# EAGLE schematic icyradio (EAGLE 9.5.1), part 1 of 2
CNAME: None; CREVISION: 1; DESIGNER: Joao Silva

## Sheet 1 of 10: SMC MCU
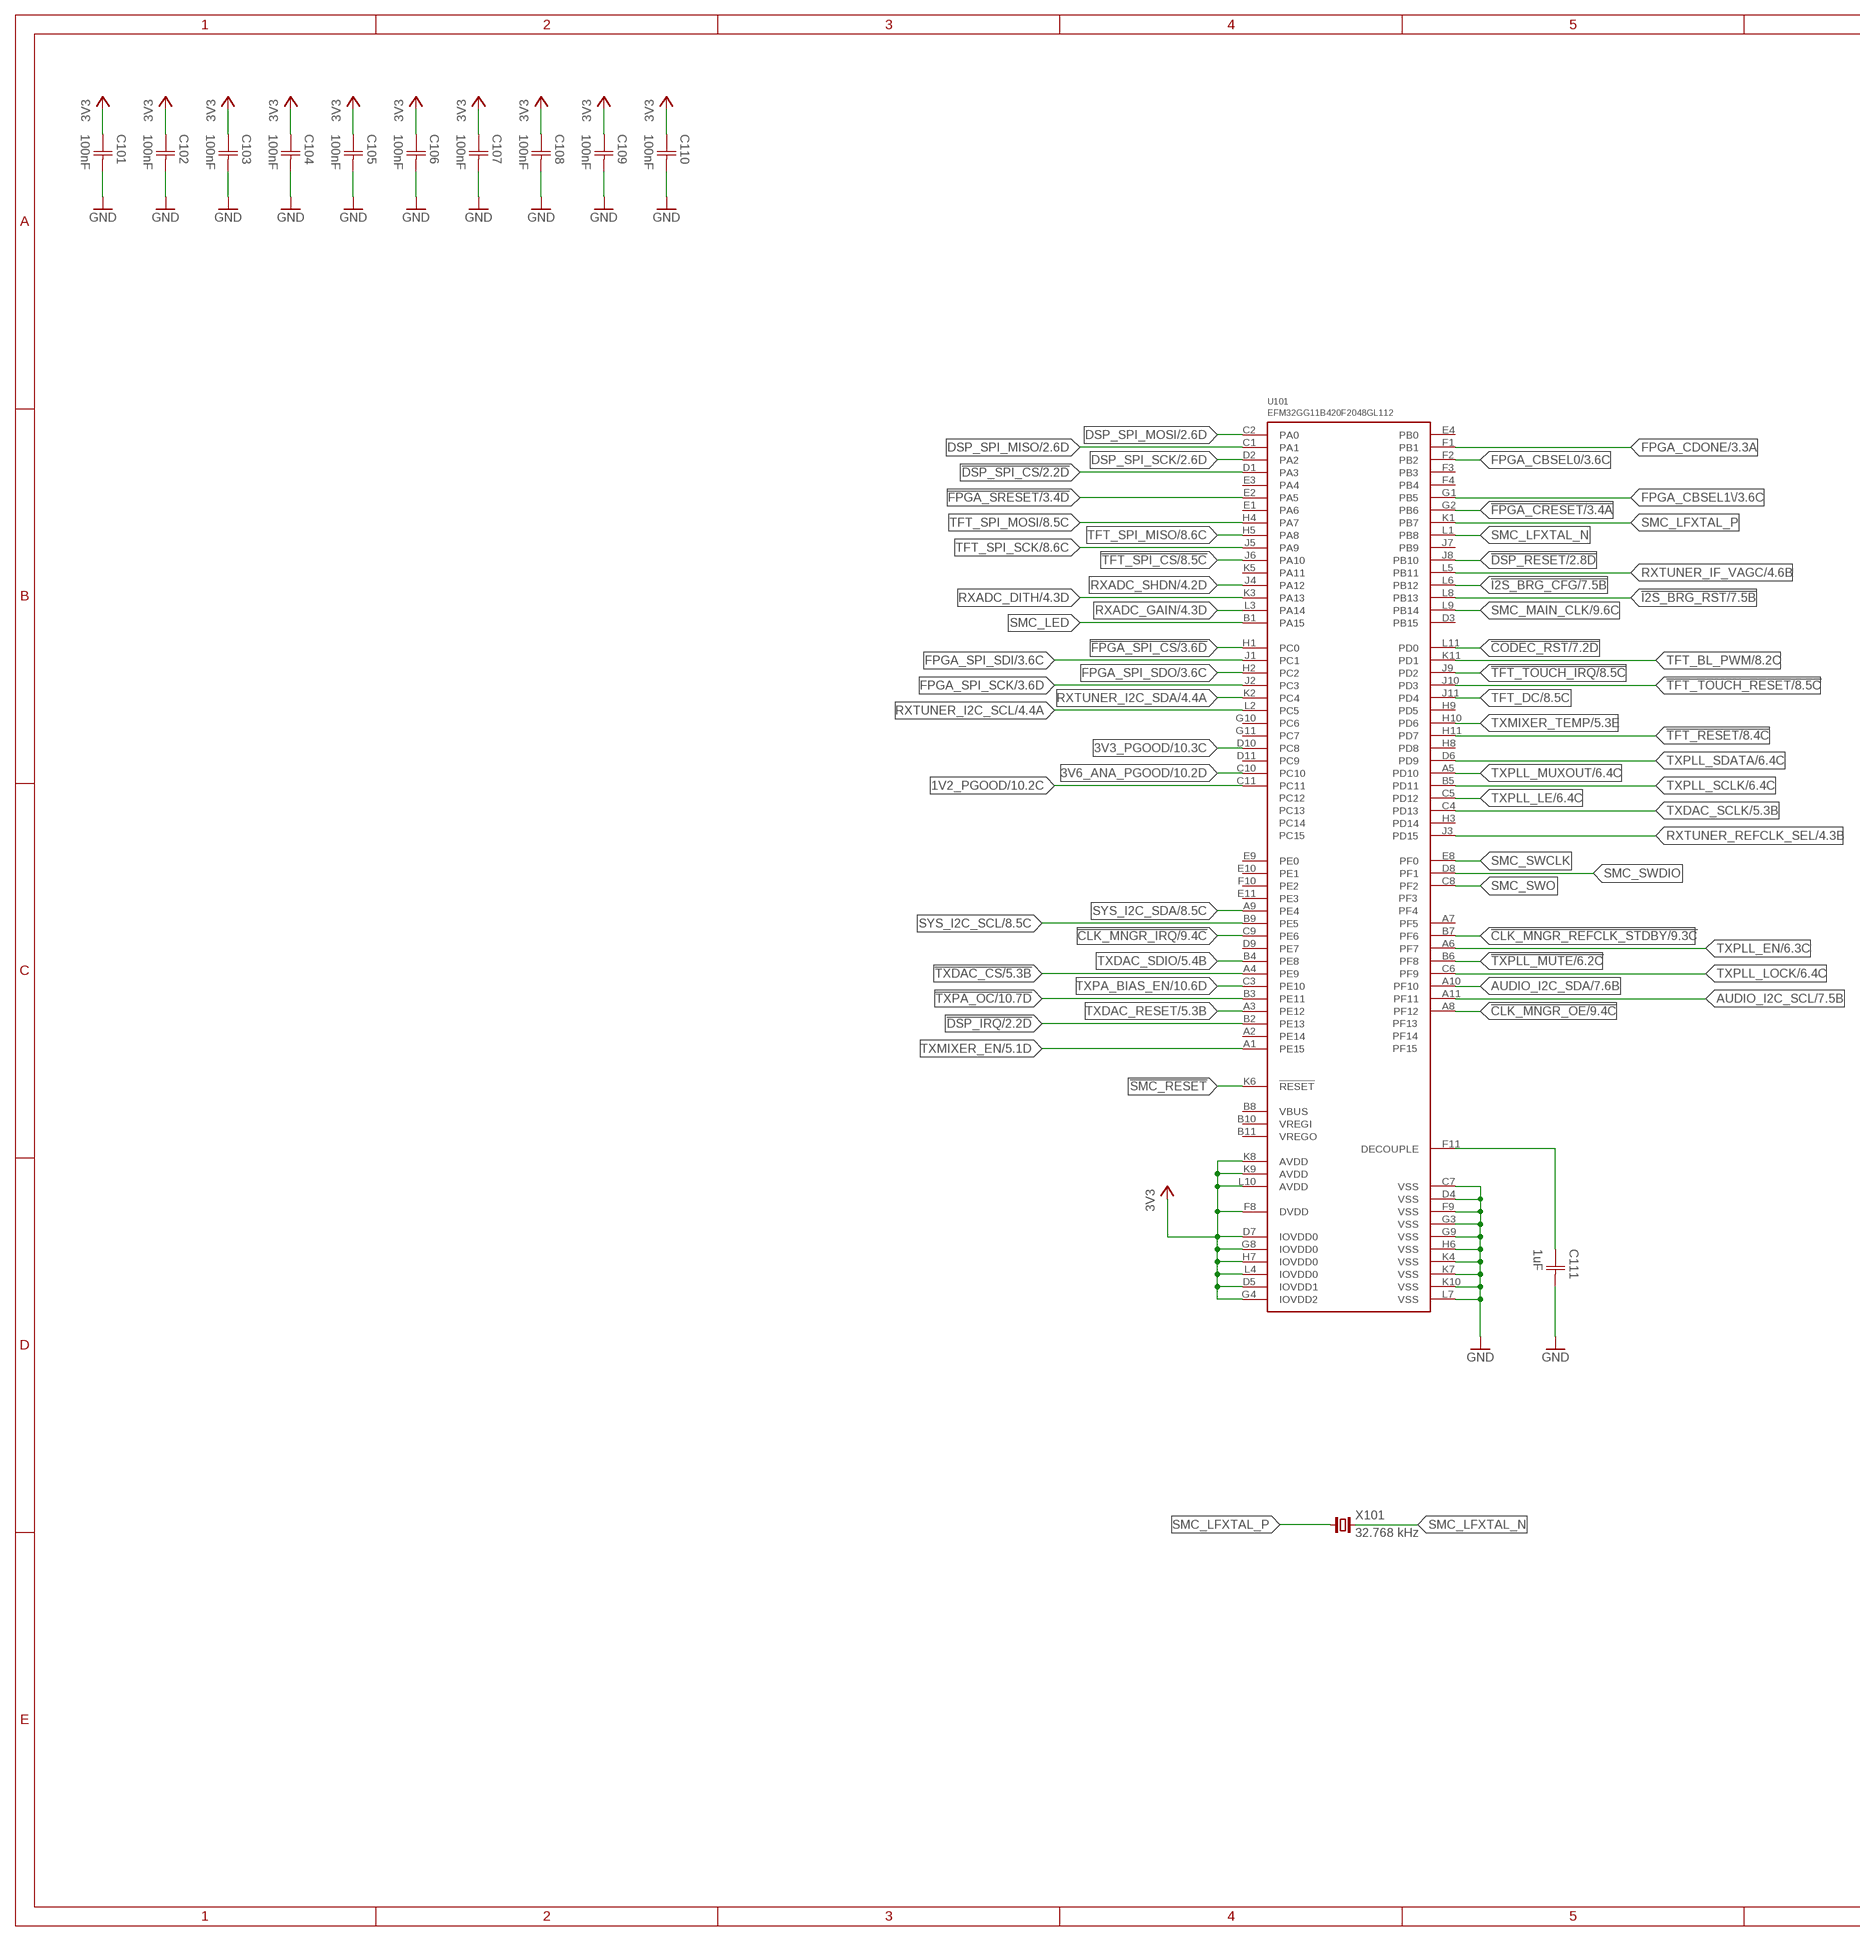
[diagram p0: schematic, sheet 1, part 1 of 2]
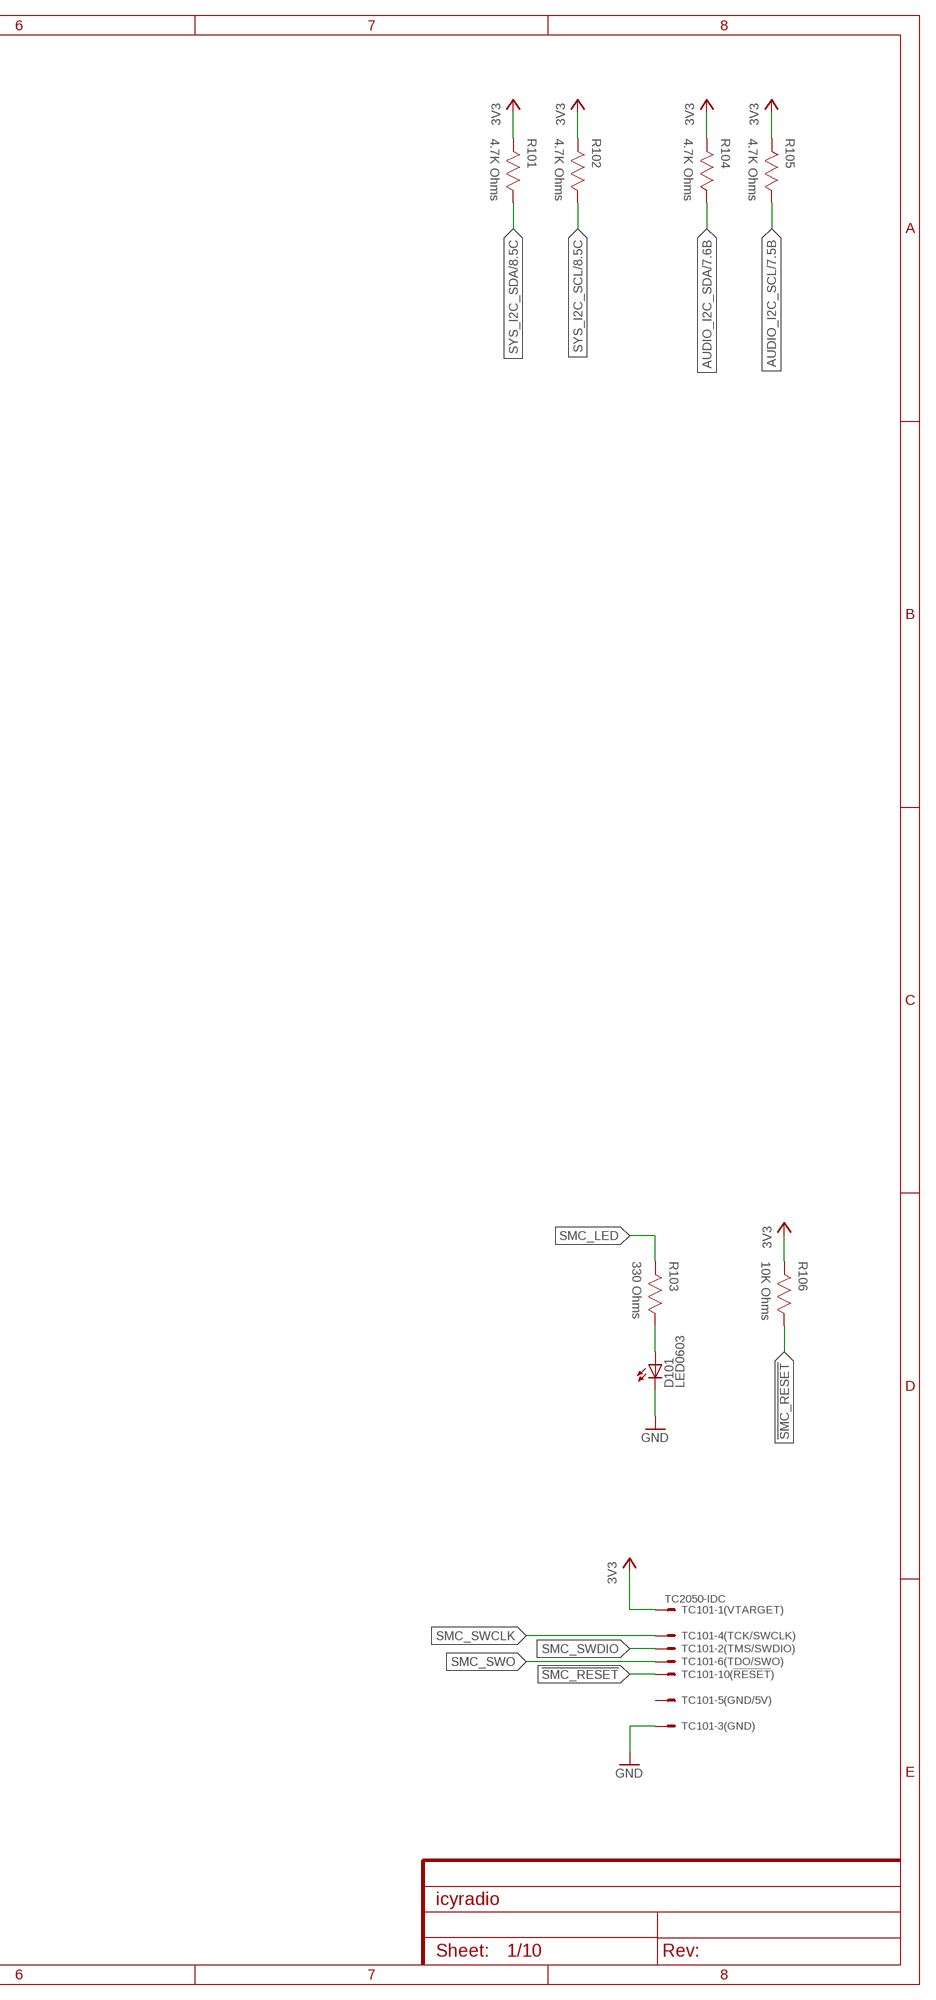
[diagram p1: schematic, sheet 1, part 2 of 2]

### Parts
C101  100nF  CAPACITOR-0603  [CAP0603]
C102  100nF  CAPACITOR-0603  [CAP0603]
C103  100nF  CAPACITOR-0603  [CAP0603]
C104  100nF  CAPACITOR-0603  [CAP0603]
C105  100nF  CAPACITOR-0603  [CAP0603]
C106  100nF  CAPACITOR-0603  [CAP0603]
C107  100nF  CAPACITOR-0603  [CAP0603]
C108  100nF  CAPACITOR-0603  [CAP0603]
C109  100nF  CAPACITOR-0603  [CAP0603]
C110  100nF  CAPACITOR-0603  [CAP0603]
C111  1uF  CAPACITOR-0603  [CAP0603]
D101  LED0603  [0603]
R101  4.7K Ohms  RESISTOR-0603  [RES0603]
R102  4.7K Ohms  RESISTOR-0603  [RES0603]
R103  330 Ohms  RESISTOR-0603  [RES0603]
R104  4.7K Ohms  RESISTOR-0603  [RES0603]
R105  4.7K Ohms  RESISTOR-0603  [RES0603]
R106  10K Ohms  RESISTOR-0603  [RES0603]
TC101  TC2050-IDC  [TC2050-IDC]
U101  EFM32GG11B420F2048GL112  [BGA112]
X101  32.768 kHz  CRYSTAL2-SMD-3215  [2-SMD-3215]

### Nets
1V2_PGOOD: U101.C11 ; also sheet 10
3V3: C101.1(C1) C102.1(C1) C103.1(C1) C104.1(C1) C105.1(C1) C106.1(C1) C107.1(C1) C108.1(C1) C109.1(C1) C110.1(C1) R101.2 R102.2 R104.2 R105.2 R106.2 TC101.1 U101.D5(IOVDD1) U101.D7(IOVDD0) U101.F8(DVDD) U101.G4(IOVDD2) U101.G8(IOVDD0) U101.H7(IOVDD0) U101.K8(AVDD) U101.K9(AVDD) U101.L4(IOVDD0) U101.L10(AVDD) ; also sheet 2,3,4,5,6,7,8,9,10
3V3_PGOOD: U101.D10(PC8) ; also sheet 10
3V6_ANA_PGOOD: U101.C10 ; also sheet 10
!CLK_MNGR_IRQ: U101.C9(PE6) ; also sheet 9
!CLK_MNGR_OE: U101.A8(PF12) ; also sheet 9
!CLK_MNGR_REFCLK_STDBY: U101.B7(PF6) ; also sheet 9
!CODEC_RST: U101.L11(PD0) ; also sheet 7
!DSP_IRQ: U101.B2(PE13) ; also sheet 2
!DSP_RESET: U101.J8(PB10) ; also sheet 2
!DSP_SPI_CS: U101.D1(PA3) ; also sheet 2
!FPGA_CRESET: U101.G2(PB6) ; also sheet 3
!FPGA_SPI_CS: U101.H1(PC0) ; also sheet 3
!FPGA_SRESET: U101.E2(PA5) ; also sheet 3
!I2S_BRG_CFG: U101.L6(PB12) ; also sheet 7
!I2S_BRG_RST: U101.L8(PB13) ; also sheet 7
!SMC_RESET: R106.1 TC101.10 U101.K6(!RESET)
!TFT_RESET: U101.H11(PD7) ; also sheet 8
!TFT_SPI_CS: U101.J6(PA10) ; also sheet 8
!TFT_TOUCH_IRQ: U101.J9(PD2) ; also sheet 8
!TFT_TOUCH_RESET: U101.J10(PD3) ; also sheet 8
!TXDAC_CS: U101.A4(PE9) ; also sheet 5
!TXPA_OC: U101.B3(PE11) ; also sheet 10
!TXPLL_MUTE: U101.B6(PF8) ; also sheet 6
AUDIO_I2C_SCL: R105.1 U101.A11(PF11) ; also sheet 7
AUDIO_I2C_SDA: R104.1 U101.A10(PF10) ; also sheet 7
DSP_SPI_MISO: U101.C1(PA1) ; also sheet 2
DSP_SPI_MOSI: U101.C2(PA0) ; also sheet 2
DSP_SPI_SCK: U101.D2(PA2) ; also sheet 2
FPGA_CBSEL0: U101.F2(PB2) ; also sheet 3
FPGA_CBSEL1\: U101.G1(PB5) ; also sheet 3
FPGA_CDONE: U101.F1(PB1) ; also sheet 3
FPGA_SPI_SCK: U101.J2(PC3) ; also sheet 3
FPGA_SPI_SDI: U101.J1(PC1) ; also sheet 3
FPGA_SPI_SDO: U101.H2(PC2) ; also sheet 3
GND: C101.2(C2) C102.2(C2) C103.2(C2) C104.2(C2) C105.2(C2) C106.2(C2) C107.2(C2) C108.2(C2) C109.2(C2) C110.2(C2) C111.2(C2) D101.1(C) TC101.3 U101.C7(VSS) U101.D4(VSS) U101.F9(VSS) U101.G3(VSS) U101.G9(VSS) U101.H6(VSS) U101.K4(VSS) U101.K7(VSS) U101.K10(VSS) U101.L7(VSS) ; also sheet 2,3,4,5,6,7,8,9,10
N$144: D101.2(A) R103.1
RXADC_DITH: U101.K3(PA13) ; also sheet 4
RXADC_GAIN: U101.L3(PA14) ; also sheet 4
RXADC_SHDN: U101.J4(PA12) ; also sheet 4
RXTUNER_I2C_SCL: U101.L2(PC5) ; also sheet 4
RXTUNER_I2C_SDA: U101.K2(PC4) ; also sheet 4
RXTUNER_IF_VAGC: U101.L5(PB11) ; also sheet 4
RXTUNER_REFCLK_SEL: U101.J3(PD15) ; also sheet 4
SMC_LED: R103.2 U101.B1(PA15)
SMC_LFXTAL_N: U101.L1(PB8) X101.2
SMC_LFXTAL_P: U101.K1(PB7) X101.1
SMC_MAIN_CLK: U101.L9(PB14) ; also sheet 9
SMC_SWCLK: TC101.4 U101.E8(PF0)
SMC_SWDIO: TC101.2 U101.D8(PF1)
SMC_SWO: TC101.6 U101.C8(PF2)
SMC_VCORE: C111.1(C1) U101.F11(DECOUPLE)
SYS_I2C_SCL: R102.1 U101.B9(PE5) ; also sheet 8,9
SYS_I2C_SDA: R101.1 U101.A9(PE4) ; also sheet 8,9
TFT_BL_PWM: U101.K11(PD1) ; also sheet 8
TFT_DC: U101.J11(PD4) ; also sheet 8
TFT_SPI_MISO: U101.H5(PA8) ; also sheet 8
TFT_SPI_MOSI: U101.H4(PA7) ; also sheet 8
TFT_SPI_SCK: U101.J5(PA9) ; also sheet 8
TXDAC_RESET: U101.A3(PE12) ; also sheet 5
TXDAC_SCLK: U101.C4(PD13) ; also sheet 5
TXDAC_SDIO: U101.B4(PE8) ; also sheet 5
TXMIXER_EN: U101.A1(PE15) ; also sheet 5
TXMIXER_TEMP: U101.H10(PD6) ; also sheet 5
TXPA_BIAS_EN: U101.C3(PE10) ; also sheet 10
TXPLL_EN: U101.A6(PF7) ; also sheet 6
TXPLL_LE: U101.C5(PD12) ; also sheet 6
TXPLL_LOCK: U101.C6(PF9) ; also sheet 6
TXPLL_MUXOUT: U101.A5(PD10) ; also sheet 6
TXPLL_SCLK: U101.B5(PD11) ; also sheet 6
TXPLL_SDATA: U101.D6(PD9) ; also sheet 6
Unconnected: TC101.5 TC101.7 TC101.8 TC101.9 U101.A2(PE14) U101.A7(PF5) U101.B8(VBUS) U101.B10(VREGI) U101.B11(VREGO) U101.D3(PB15) U101.D9(PE7) U101.D11(PC9) U101.E1(PA6) U101.E3(PA4) U101.E4(PB0) U101.E9(PE0) U101.E10(PE1) U101.E11(PE3) U101.F3(PB3) U101.F4(PB4) U101.F10(PE2) U101.G10(PC6) U101.G11(PC7) U101.H3(PD14) U101.H8(PD8) U101.H9(PD5) U101.J7(PB9) U101.K5(PA11)

## Sheet 2 of 10: DSP MCU
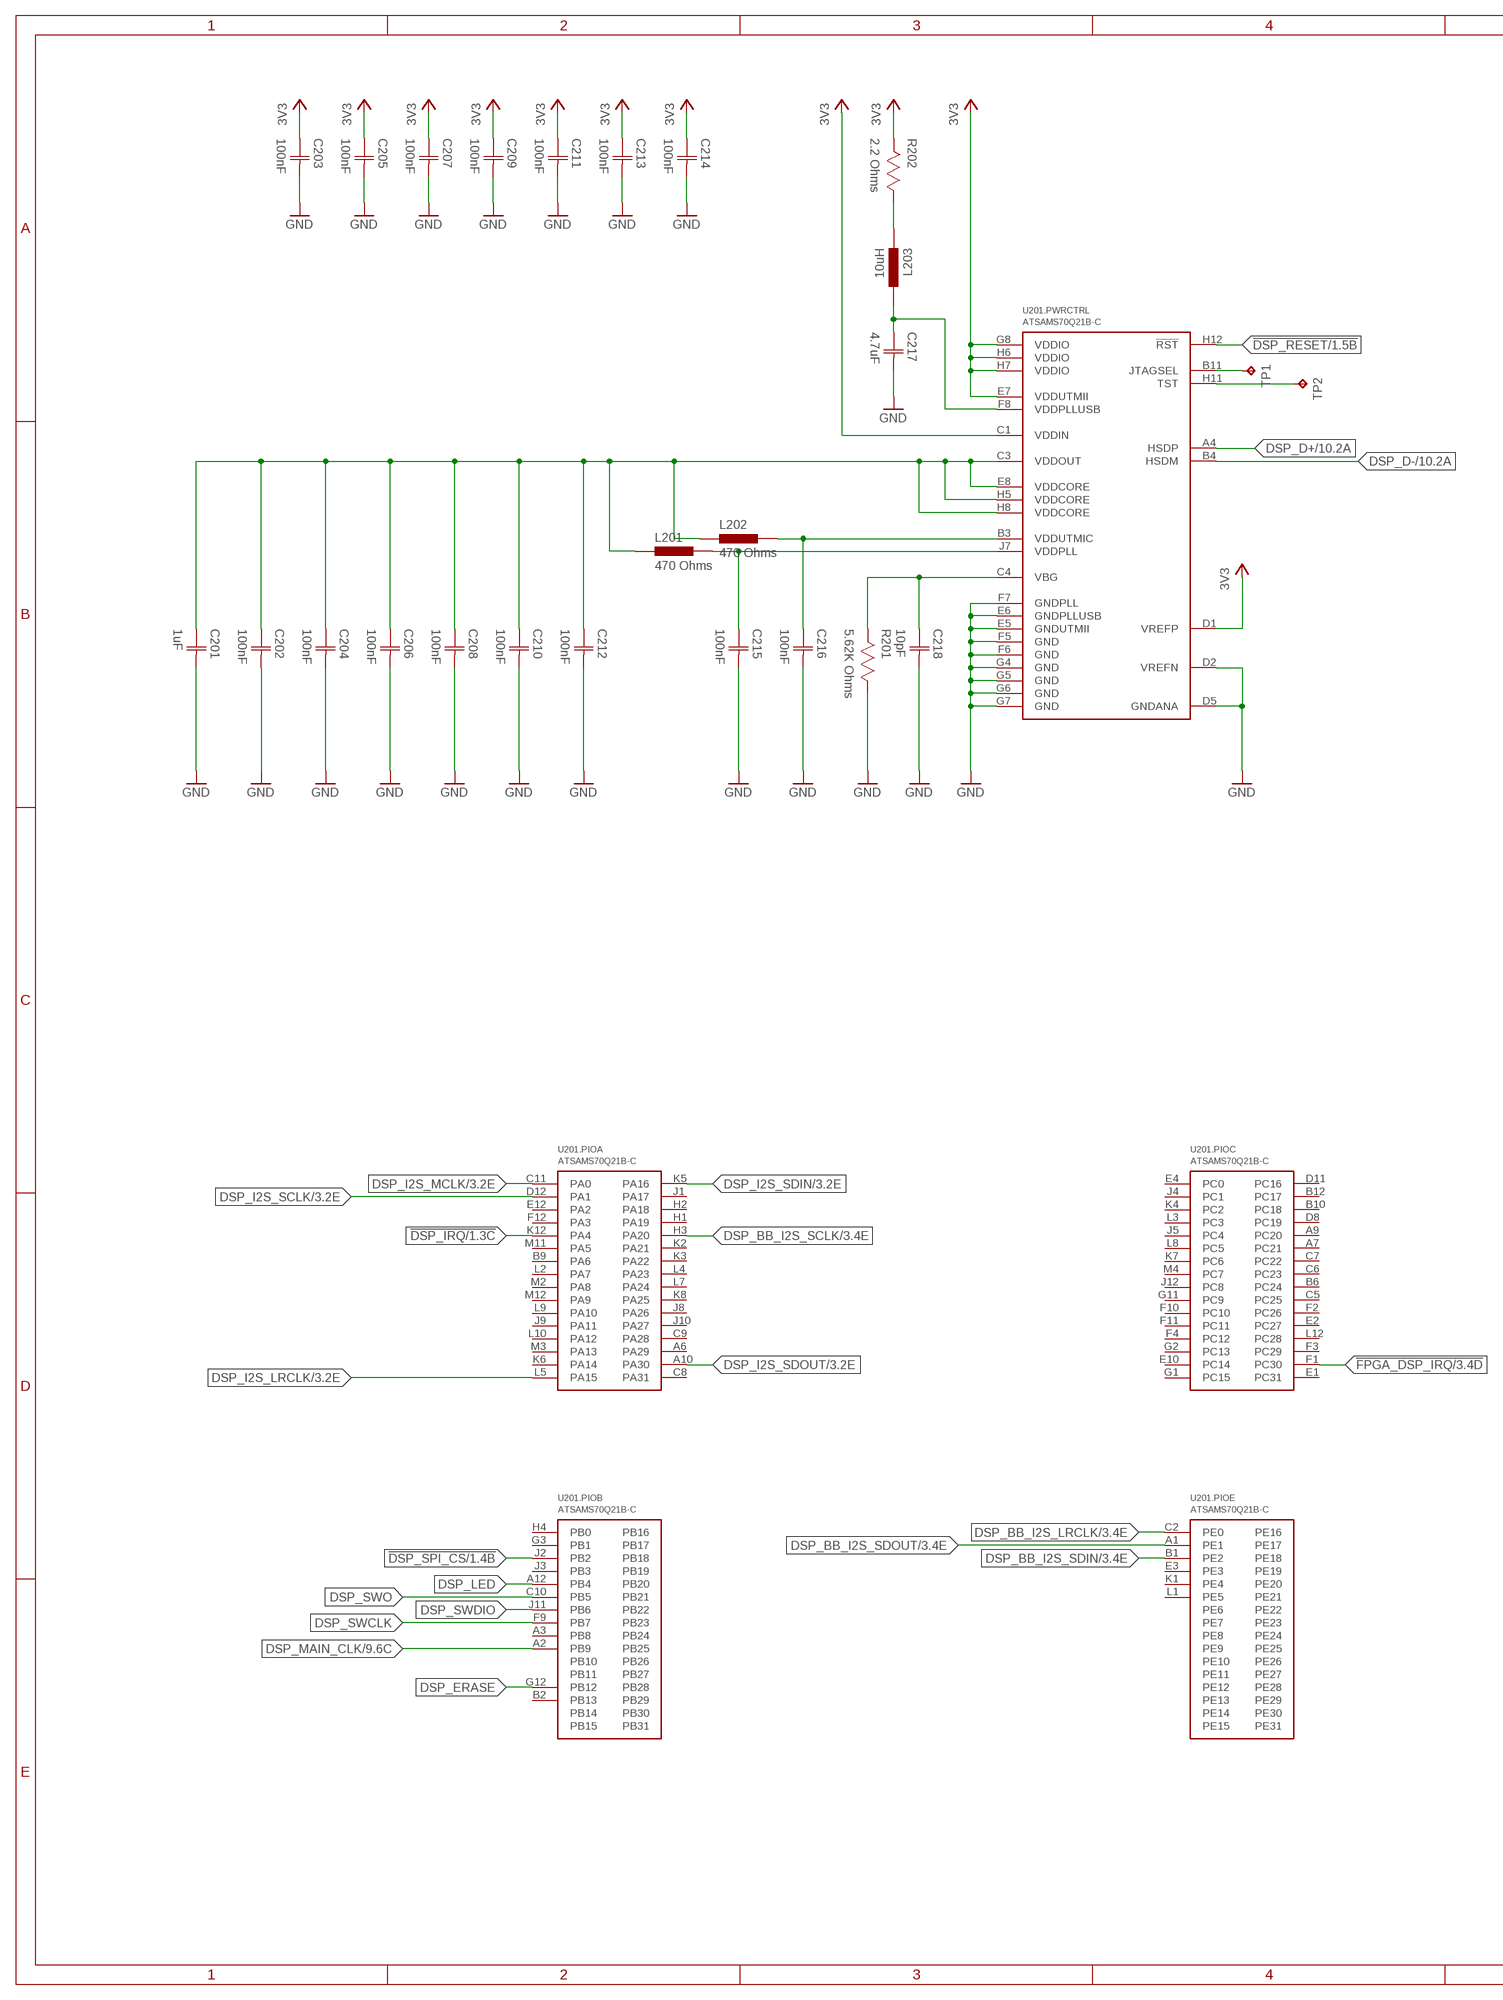
[diagram p2: schematic, sheet 2, part 1 of 2]
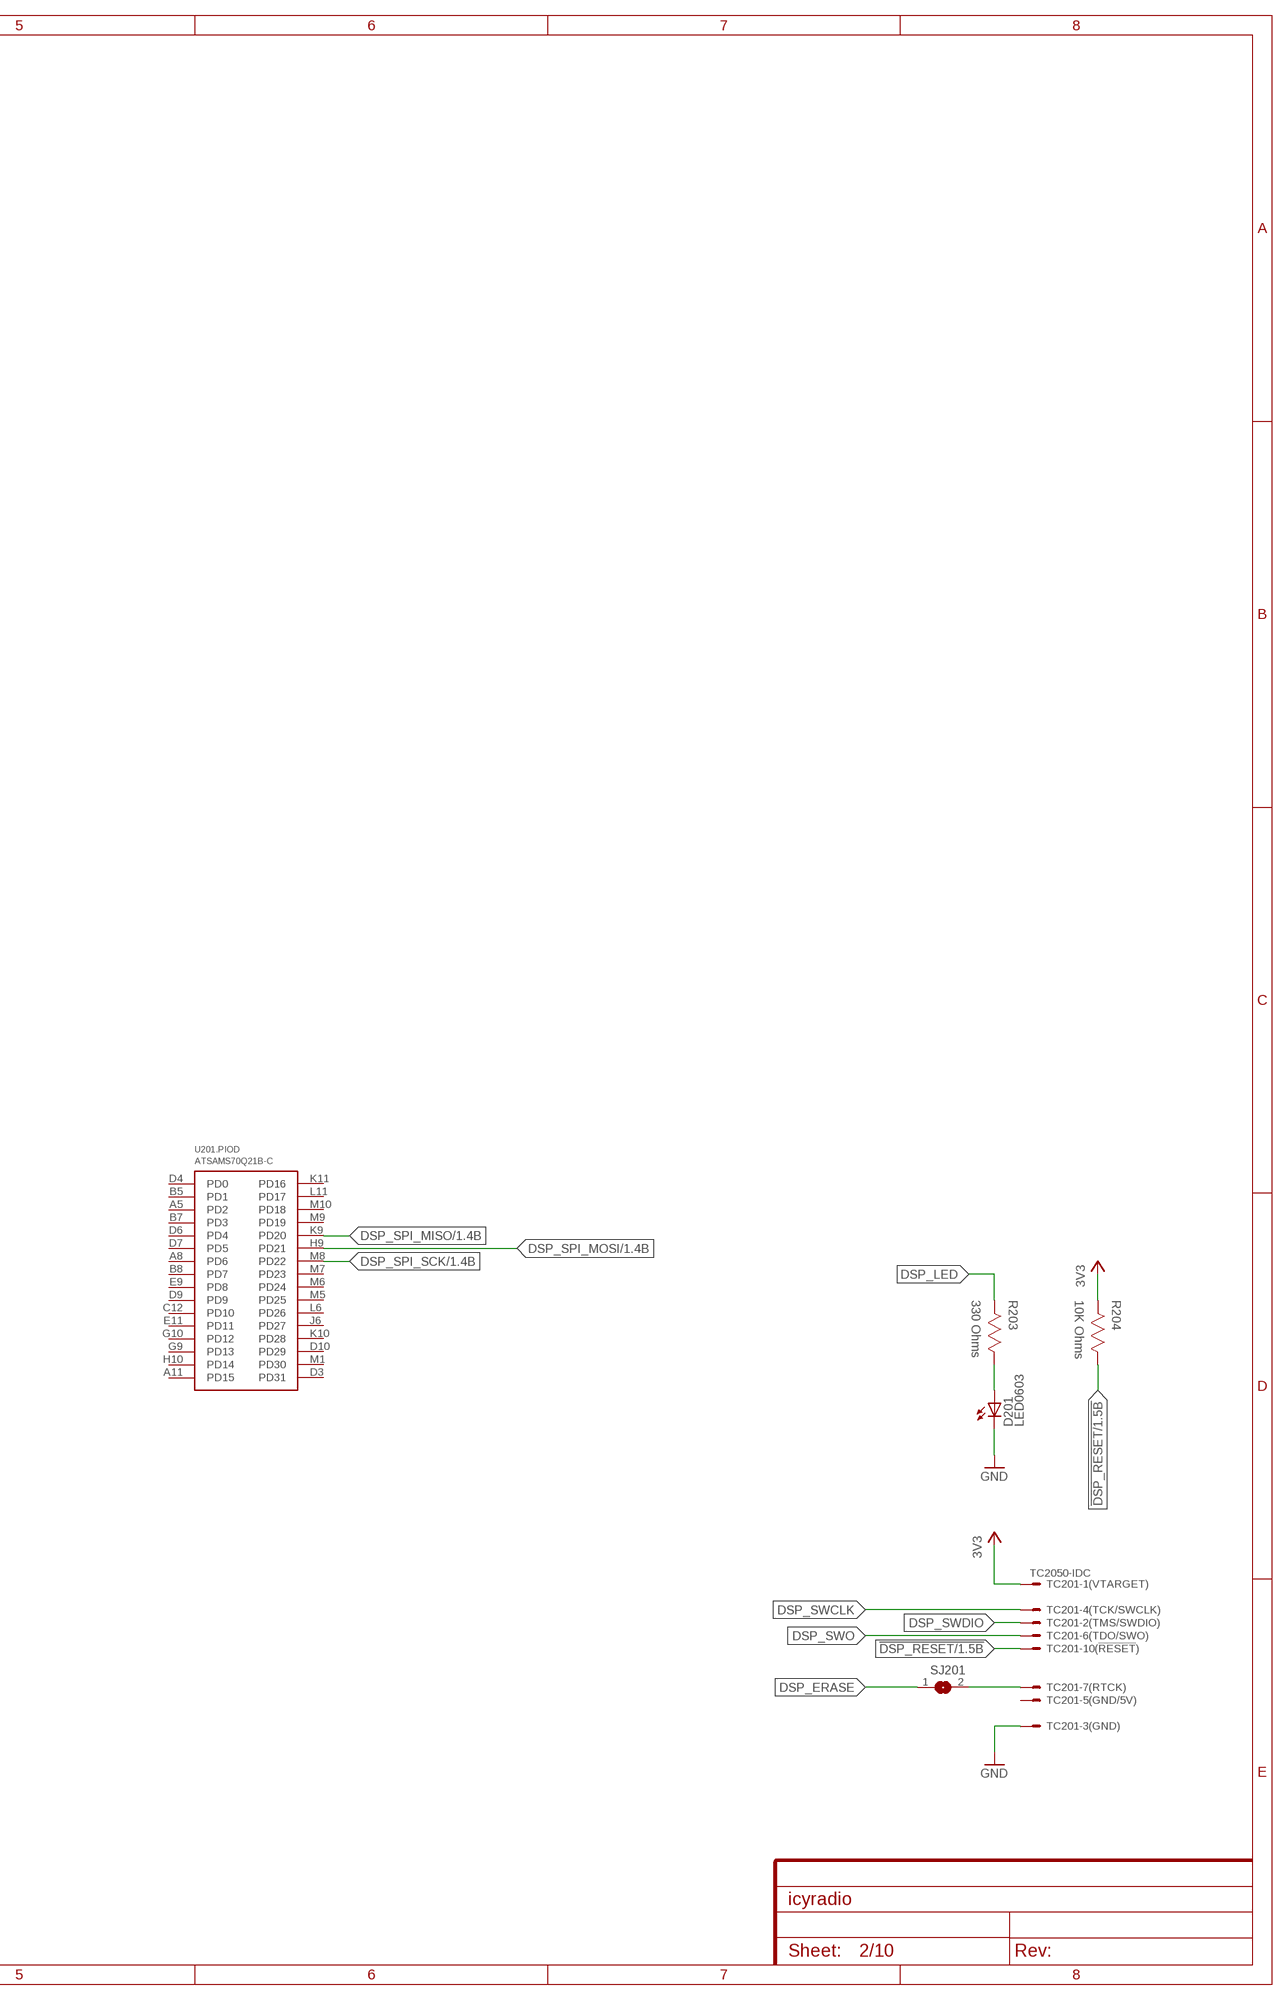
[diagram p3: schematic, sheet 2, part 2 of 2]

### Parts
C201  1uF  CAPACITOR-0603  [CAP0603]
C202  100nF  CAPACITOR-0603  [CAP0603]
C203  100nF  CAPACITOR-0603  [CAP0603]
C204  100nF  CAPACITOR-0603  [CAP0603]
C205  100nF  CAPACITOR-0603  [CAP0603]
C206  100nF  CAPACITOR-0603  [CAP0603]
C207  100nF  CAPACITOR-0603  [CAP0603]
C208  100nF  CAPACITOR-0603  [CAP0603]
C209  100nF  CAPACITOR-0603  [CAP0603]
C210  100nF  CAPACITOR-0603  [CAP0603]
C211  100nF  CAPACITOR-0603  [CAP0603]
C212  100nF  CAPACITOR-0603  [CAP0603]
C213  100nF  CAPACITOR-0603  [CAP0603]
C214  100nF  CAPACITOR-0603  [CAP0603]
C215  100nF  CAPACITOR-0603  [CAP0603]
C216  100nF  CAPACITOR-0603  [CAP0603]
C217  4.7uF  CAPACITOR-0603  [CAP0603]
C218  10pF  CAPACITOR-0603  [CAP0603]
D201  LED0603  [0603]
L201  470 Ohms  INDUCTOR-0603  [IND0603]
L202  470 Ohms  INDUCTOR-0603  [IND0603]
L203  10uH  INDUCTOR-0603  [IND0603]
R201  5.62K Ohms  RESISTOR-0603  [RES0603]
R202  2.2 Ohms  RESISTOR-0603  [RES0603]
R203  330 Ohms  RESISTOR-0603  [RES0603]
R204  10K Ohms  RESISTOR-0603  [RES0603]
SJ201  SJS  [SJ_S]
TC201  TC2050-IDC  [TC2050-IDC]
TP1  TESTPOINT-0.7MM  [PAD0.7MM]
TP2  TESTPOINT-0.7MM  [PAD0.7MM]
U201  ATSAMS70Q21B-C  [LFBGA144]

### Nets
3V3: C203.1(C1) C205.1(C1) C207.1(C1) C209.1(C1) C211.1(C1) C213.1(C1) C214.1(C1) R202.2 R204.2 TC201.1 U201.C1(.PWRCTRL:VDDIN) U201.D1(.PWRCTRL:VREFP) U201.E7(.PWRCTRL:VDDUTMII) U201.G8(.PWRCTRL:VDDIO) U201.H6(.PWRCTRL:VDDIO) U201.H7(.PWRCTRL:VDDIO) ; also sheet 1,3,4,5,6,7,8,9,10
!DSP_IRQ: U201.K12(.PIOA:PA4) ; also sheet 1
!DSP_RESET: R204.1 TC201.10 U201.H12(.PWRCTRL:!RST) ; also sheet 1
!DSP_SPI_CS: U201.J2(.PIOB:PB2) ; also sheet 1
!FPGA_DSP_IRQ: U201.F1(.PIOC:PC30) ; also sheet 3
DSP_BB_I2S_LRCLK: U201.C2(.PIOE:PE0) ; also sheet 3
DSP_BB_I2S_SCLK: U201.H3(.PIOA:PA20) ; also sheet 3
DSP_BB_I2S_SDIN: U201.B1(.PIOE:PE2) ; also sheet 3
DSP_BB_I2S_SDOUT: U201.A1(.PIOE:PE1) ; also sheet 3
DSP_D+: U201.A4(.PWRCTRL:HSDP) ; also sheet 10
DSP_D-: U201.B4(.PWRCTRL:HSDM) ; also sheet 10
DSP_ERASE: SJ201.1 U201.G12(.PIOB:PB12)
DSP_I2S_LRCLK: U201.L5(.PIOA:PA15) ; also sheet 3
DSP_I2S_MCLK: U201.C11(.PIOA:PA0) ; also sheet 3
DSP_I2S_SCLK: U201.D12(.PIOA:PA1) ; also sheet 3
DSP_I2S_SDIN: U201.K5(.PIOA:PA16) ; also sheet 3
DSP_I2S_SDOUT: U201.A10(.PIOA:PA30) ; also sheet 3
DSP_JTAGSEL: TP1.TP U201.B11(.PWRCTRL:JTAGSEL)
DSP_LED: R203.2 U201.A12(.PIOB:PB4)
DSP_MAIN_CLK: U201.A2(.PIOB:PB9) ; also sheet 9
DSP_SPI_MISO: U201.K9(.PIOD:PD20) ; also sheet 1
DSP_SPI_MOSI: U201.H9(.PIOD:PD21) ; also sheet 1
DSP_SPI_SCK: U201.M8(.PIOD:PD22) ; also sheet 1
DSP_SWCLK: TC201.4 U201.F9(.PIOB:PB7)
DSP_SWDIO: TC201.2 U201.J11(.PIOB:PB6)
DSP_SWO: TC201.6 U201.C10(.PIOB:PB5)
DSP_TST: TP2.TP U201.H11(.PWRCTRL:TST)
DSP_VDDOUT: C201.1(C1) C202.1(C1) C204.1(C1) C206.1(C1) C208.1(C1) C210.1(C1) C212.1(C1) L201.1 L202.1 U201.C3(.PWRCTRL:VDDOUT) U201.E8(.PWRCTRL:VDDCORE) U201.H5(.PWRCTRL:VDDCORE) U201.H8(.PWRCTRL:VDDCORE)
DSP_VDDPLLUSB: C217.1(C1) L203.2 U201.F8(.PWRCTRL:VDDPLLUSB)
GND: C201.2(C2) C202.2(C2) C203.2(C2) C204.2(C2) C205.2(C2) C206.2(C2) C207.2(C2) C208.2(C2) C209.2(C2) C210.2(C2) C211.2(C2) C212.2(C2) C213.2(C2) C214.2(C2) C215.2(C2) C216.2(C2) C217.2(C2) C218.2(C2) D201.1(C) R201.1 TC201.3 U201.D2(.PWRCTRL:VREFN) U201.D5(.PWRCTRL:GNDANA) U201.E5(.PWRCTRL:GNDUTMII) U201.E6(.PWRCTRL:GNDPLLUSB) U201.F5(.PWRCTRL:GND) U201.F6(.PWRCTRL:GND) U201.F7(.PWRCTRL:GNDPLL) U201.G4(.PWRCTRL:GND) U201.G5(.PWRCTRL:GND) U201.G6(.PWRCTRL:GND) U201.G7(.PWRCTRL:GND) ; also sheet 1,3,4,5,6,7,8,9,10
N$95: L203.1 R202.1
N$96: C218.1(C1) R201.2 U201.C4(.PWRCTRL:VBG)
N$97: C215.1(C1) L201.2 U201.J7(.PWRCTRL:VDDPLL)
N$98: C216.1(C1) L202.2 U201.B3(.PWRCTRL:VDDUTMIC)
N$104: SJ201.2 TC201.7
N$145: D201.2(A) R203.1
Unconnected: TC201.5 TC201.8 TC201.9 U201.A3(.PIOB:PB8) U201.A5(.PIOD:PD2) U201.A6(.PIOA:PA29) U201.A7(.PIOC:PC21) U201.A8(.PIOD:PD6) U201.A9(.PIOC:PC20) U201.A11(.PIOD:PD15) U201.B2(.PIOB:PB13) U201.B5(.PIOD:PD1) U201.B6(.PIOC:PC24) U201.B7(.PIOD:PD3) U201.B8(.PIOD:PD7) U201.B9(.PIOA:PA6) U201.B10(.PIOC:PC18) U201.B12(.PIOC:PC17) U201.C5(.PIOC:PC25) U201.C6(.PIOC:PC23) U201.C7(.PIOC:PC22) U201.C8(.PIOA:PA31) U201.C9(.PIOA:PA28) U201.C12(.PIOD:PD10) U201.D3(.PIOD:PD31) U201.D4(.PIOD:PD0) U201.D6(.PIOD:PD4) U201.D7(.PIOD:PD5) U201.D8(.PIOC:PC19) U201.D9(.PIOD:PD9) U201.D10(.PIOD:PD29) U201.D11(.PIOC:PC16) U201.E1(.PIOC:PC31) U201.E2(.PIOC:PC27) U201.E3(.PIOE:PE3) U201.E4(.PIOC:PC0) U201.E9(.PIOD:PD8) U201.E10(.PIOC:PC14) U201.E11(.PIOD:PD11) U201.E12(.PIOA:PA2) U201.F2(.PIOC:PC26) U201.F3(.PIOC:PC29) U201.F4(.PIOC:PC12) U201.F10(.PIOC:PC10) U201.F11(.PIOC:PC11) U201.F12(.PIOA:PA3) U201.G1(.PIOC:PC15) U201.G2(.PIOC:PC13) U201.G3(.PIOB:PB1) U201.G9(.PIOD:PD13) U201.G10(.PIOD:PD12) U201.G11(.PIOC:PC9) U201.H1(.PIOA:PA19) U201.H2(.PIOA:PA18) U201.H4(.PIOB:PB0) U201.H10(.PIOD:PD14) U201.J1(.PIOA:PA17) U201.J3(.PIOB:PB3) U201.J4(.PIOC:PC1) U201.J5(.PIOC:PC4) U201.J6(.PIOD:PD27) U201.J8(.PIOA:PA26) U201.J9(.PIOA:PA11) U201.J10(.PIOA:PA27) U201.J12(.PIOC:PC8) U201.K1(.PIOE:PE4) U201.K2(.PIOA:PA21) U201.K3(.PIOA:PA22) U201.K4(.PIOC:PC2) U201.K6(.PIOA:PA14) U201.K7(.PIOC:PC6) U201.K8(.PIOA:PA25) U201.K10(.PIOD:PD28) U201.K11(.PIOD:PD16) U201.L1(.PIOE:PE5) U201.L2(.PIOA:PA7) U201.L3(.PIOC:PC3) U201.L4(.PIOA:PA23) U201.L6(.PIOD:PD26) U201.L7(.PIOA:PA24) U201.L8(.PIOC:PC5) U201.L9(.PIOA:PA10) U201.L10(.PIOA:PA12) U201.L11(.PIOD:PD17) U201.L12(.PIOC:PC28) U201.M1(.PIOD:PD30) U201.M2(.PIOA:PA8) U201.M3(.PIOA:PA13) U201.M4(.PIOC:PC7) U201.M5(.PIOD:PD25) U201.M6(.PIOD:PD24) U201.M7(.PIOD:PD23) U201.M9(.PIOD:PD19) U201.M10(.PIOD:PD18) U201.M11(.PIOA:PA5) U201.M12(.PIOA:PA9)

## Sheet 3 of 10: FPGA
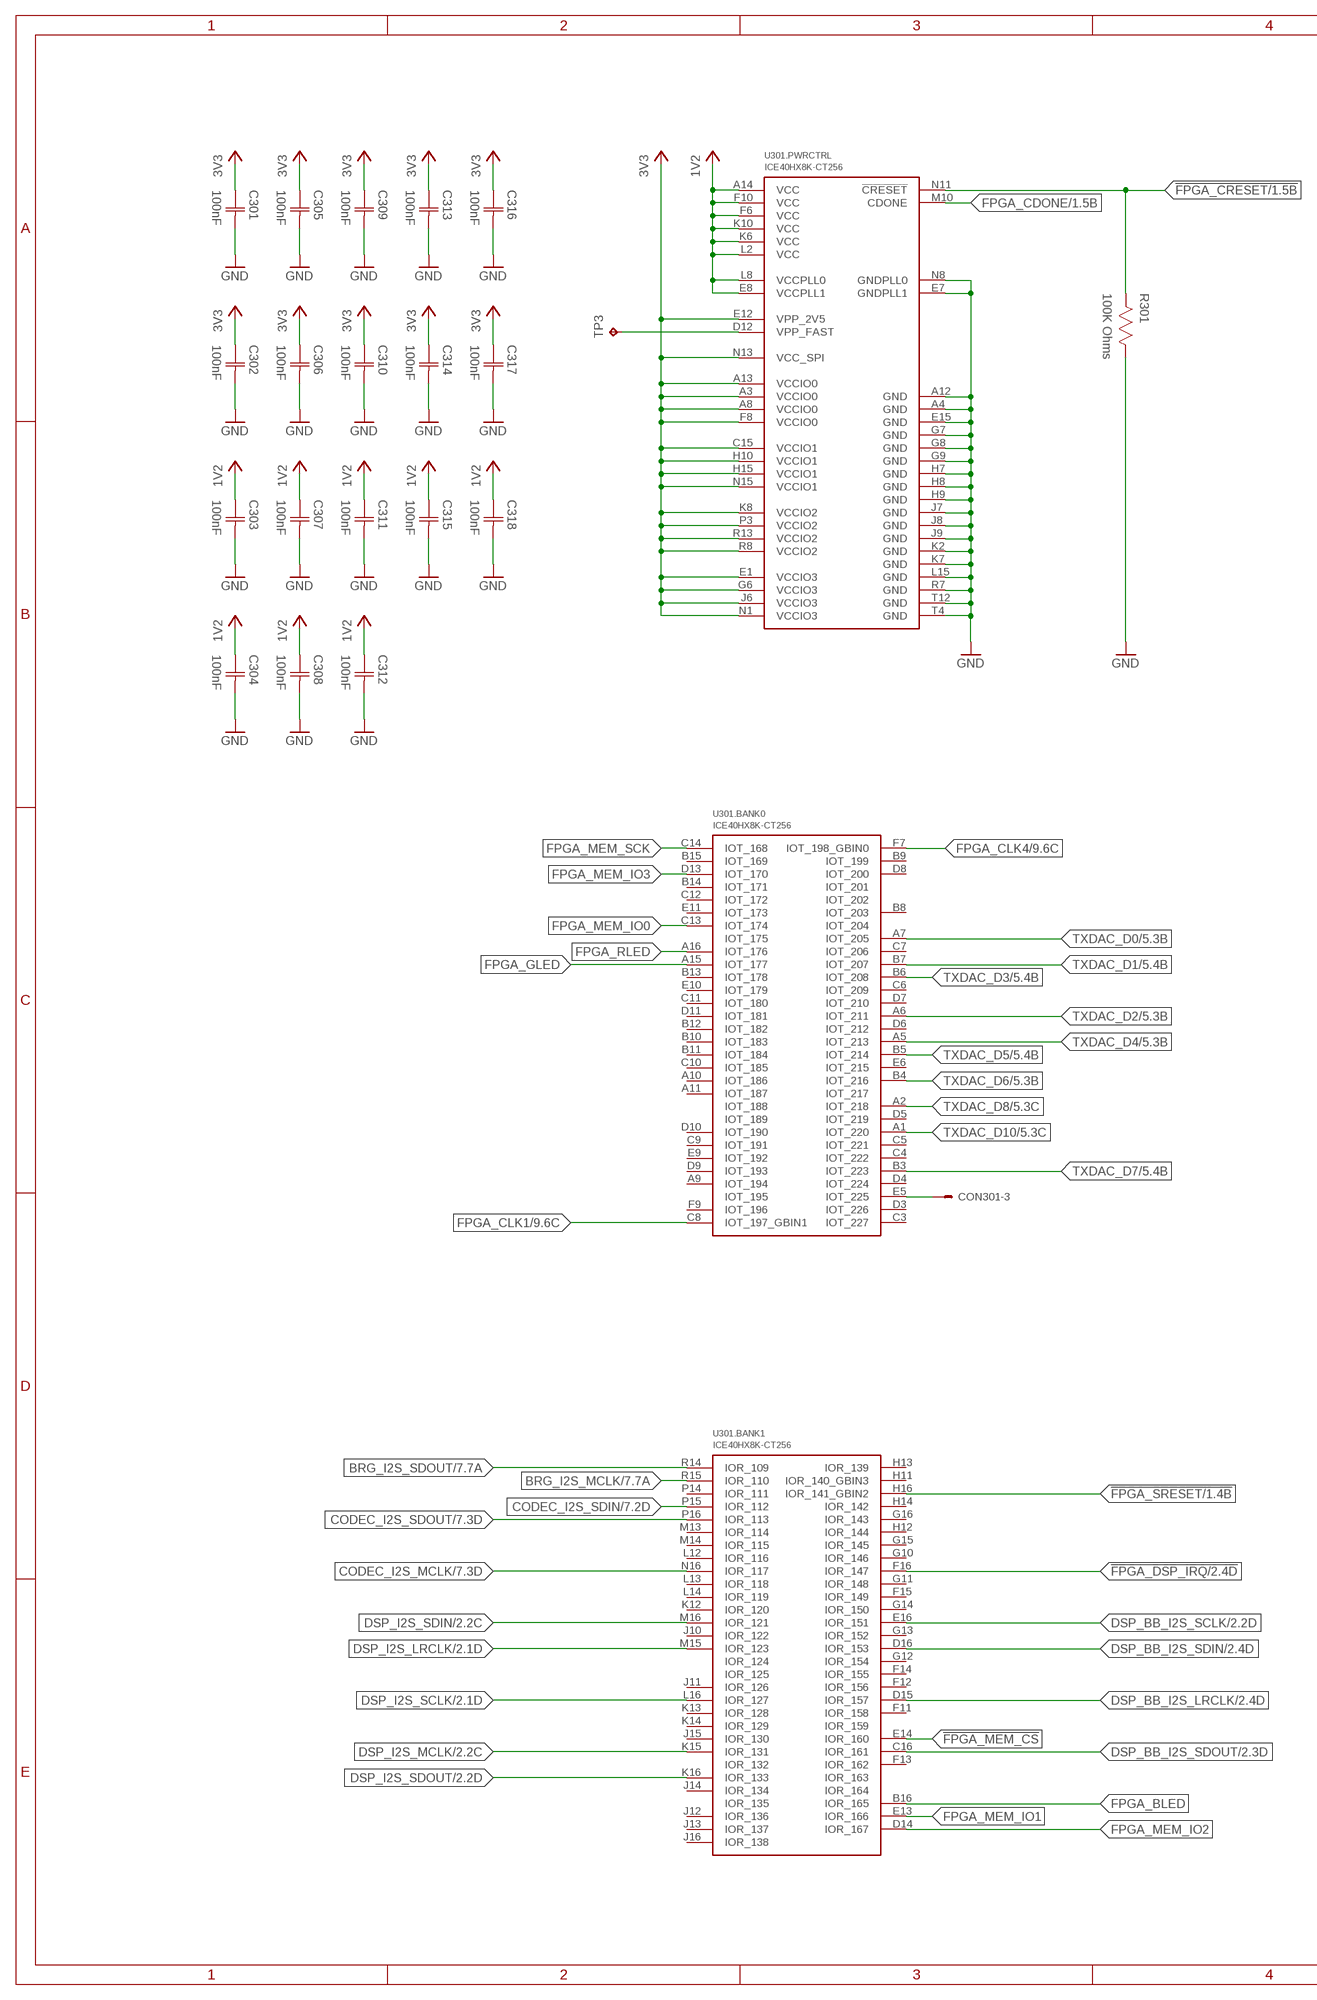
[diagram p4: schematic, sheet 3, part 1 of 2]
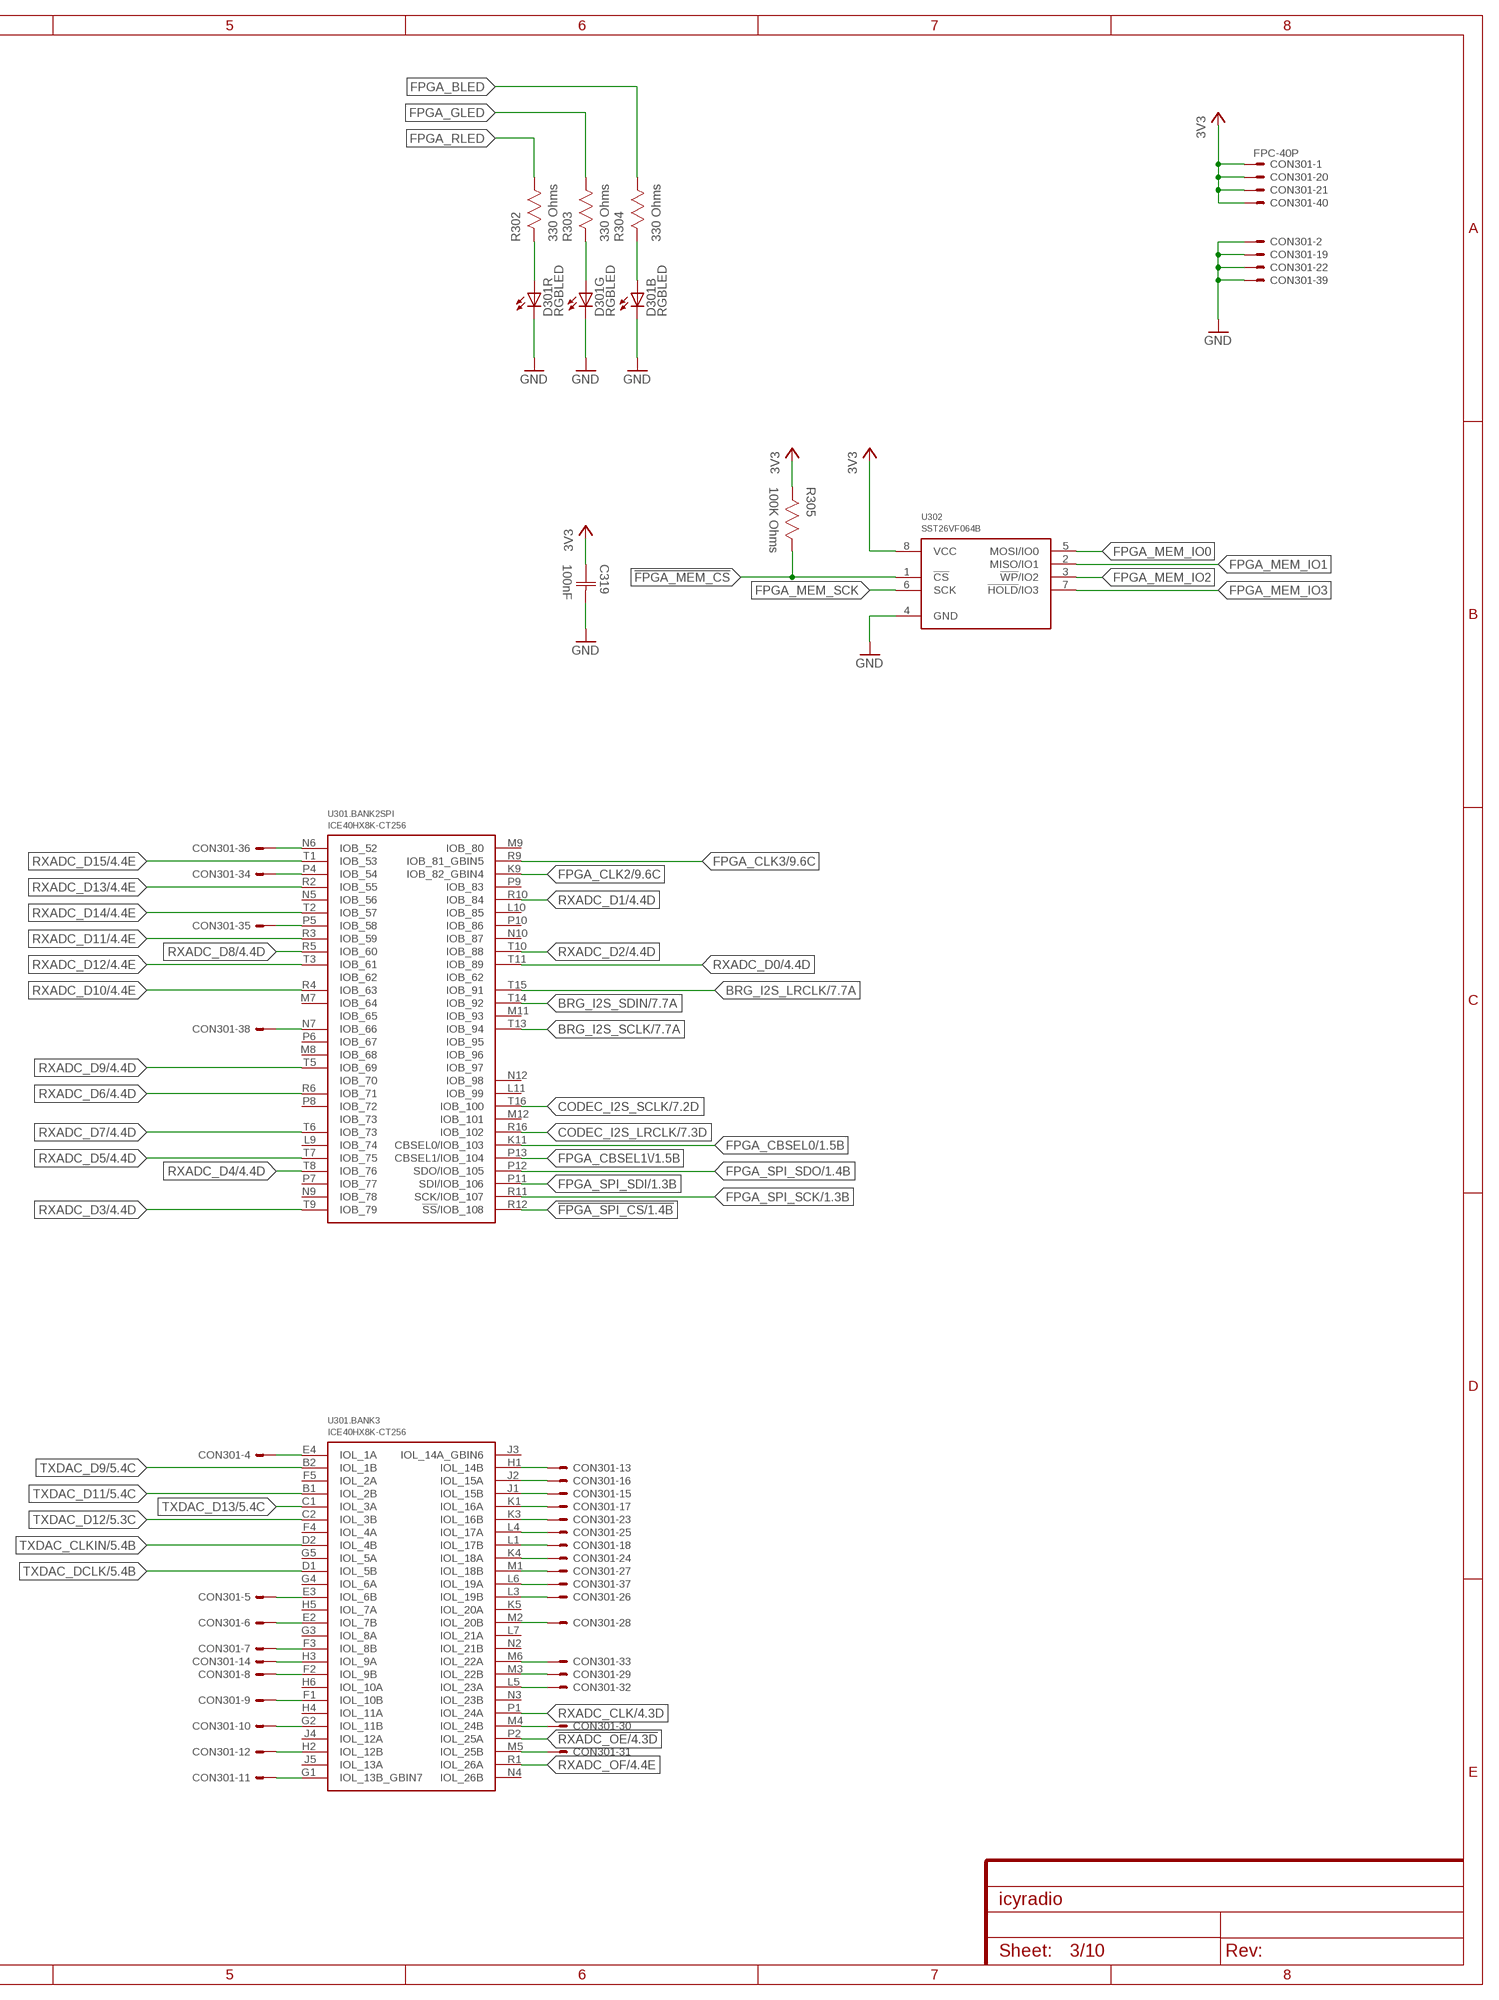
[diagram p5: schematic, sheet 3, part 2 of 2]

### Parts
C301  100nF  CAPACITOR-0603  [CAP0603]
C302  100nF  CAPACITOR-0603  [CAP0603]
C303  100nF  CAPACITOR-0603  [CAP0603]
C304  100nF  CAPACITOR-0603  [CAP0603]
C305  100nF  CAPACITOR-0603  [CAP0603]
C306  100nF  CAPACITOR-0603  [CAP0603]
C307  100nF  CAPACITOR-0603  [CAP0603]
C308  100nF  CAPACITOR-0603  [CAP0603]
C309  100nF  CAPACITOR-0603  [CAP0603]
C310  100nF  CAPACITOR-0603  [CAP0603]
C311  100nF  CAPACITOR-0603  [CAP0603]
C312  100nF  CAPACITOR-0603  [CAP0603]
C313  100nF  CAPACITOR-0603  [CAP0603]
C314  100nF  CAPACITOR-0603  [CAP0603]
C315  100nF  CAPACITOR-0603  [CAP0603]
C316  100nF  CAPACITOR-0603  [CAP0603]
C317  100nF  CAPACITOR-0603  [CAP0603]
C318  100nF  CAPACITOR-0603  [CAP0603]
C319  100nF  CAPACITOR-0603  [CAP0603]
CON301  FPC-40P  [FPC-40P]
D301  RGBLED  [5050]
R301  100K Ohms  RESISTOR-0603  [RES0603]
R302  330 Ohms  RESISTOR-0603  [RES0603]
R303  330 Ohms  RESISTOR-0603  [RES0603]
R304  330 Ohms  RESISTOR-0603  [RES0603]
R305  100K Ohms  RESISTOR-0603  [RES0603]
TP3  TESTPOINT-0.7MM  [PAD0.7MM]
U301  ICE40HX8K-CT256  [CABGA256]
U302  SST26VF064B  [WSOIC8]

### Nets
1V2: C303.1(C1) C304.1(C1) C307.1(C1) C308.1(C1) C311.1(C1) C312.1(C1) C315.1(C1) C318.1(C1) U301.A14(.PWRCTRL:VCC) U301.E8(.PWRCTRL:VCCPLL1) U301.F6(.PWRCTRL:VCC) U301.F10(.PWRCTRL:VCC) U301.K6(.PWRCTRL:VCC) U301.K10(.PWRCTRL:VCC) U301.L2(.PWRCTRL:VCC) U301.L8(.PWRCTRL:VCCPLL0) ; also sheet 10
3V3: C301.1(C1) C302.1(C1) C305.1(C1) C306.1(C1) C309.1(C1) C310.1(C1) C313.1(C1) C314.1(C1) C316.1(C1) C317.1(C1) C319.1(C1) CON301.1 CON301.20 CON301.21 CON301.40 R305.2 U301.A3(.PWRCTRL:VCCIO0) U301.A8(.PWRCTRL:VCCIO0) U301.A13(.PWRCTRL:VCCIO0) U301.C15(.PWRCTRL:VCCIO1) U301.E1(.PWRCTRL:VCCIO3) U301.E12(.PWRCTRL:VPP_2V5) U301.F8(.PWRCTRL:VCCIO0) U301.G6(.PWRCTRL:VCCIO3) U301.H10(.PWRCTRL:VCCIO1) U301.H15(.PWRCTRL:VCCIO1) U301.J6(.PWRCTRL:VCCIO3) U301.K8(.PWRCTRL:VCCIO2) U301.N1(.PWRCTRL:VCCIO3) U301.N13(.PWRCTRL:VCC_SPI) U301.N15(.PWRCTRL:VCCIO1) U301.P3(.PWRCTRL:VCCIO2) U301.R8(.PWRCTRL:VCCIO2) U301.R13(.PWRCTRL:VCCIO2) U302.8(VCC) ; also sheet 1,2,4,5,6,7,8,9,10
!FPGA_CRESET: R301.2 U301.N11(.PWRCTRL:!CRESET) ; also sheet 1
!FPGA_DSP_IRQ: U301.F16(.BANK1:IOR_147) ; also sheet 2
!FPGA_MEM_CS: R305.1 U301.E14(.BANK1:IOR_160) U302.1(!CS!)
!FPGA_SPI_CS: U301.R12(.BANK2SPI:!SS!/IOB_108) ; also sheet 1
!FPGA_SRESET: U301.H16(.BANK1:IOR_141_GBIN2) ; also sheet 1
!RXADC_OE: U301.P2(.BANK3:IOL_25A) ; also sheet 4
BRG_I2S_LRCLK: U301.T15(.BANK2SPI:IOB_91) ; also sheet 7
BRG_I2S_MCLK: U301.R15(.BANK1:IOR_110) ; also sheet 7
BRG_I2S_SCLK: U301.T13(.BANK2SPI:IOB_94) ; also sheet 7
BRG_I2S_SDIN: U301.T14(.BANK2SPI:IOB_92) ; also sheet 7
BRG_I2S_SDOUT: U301.R14(.BANK1:IOR_109) ; also sheet 7
CODEC_I2S_LRCLK: U301.R16(.BANK2SPI:IOB_102) ; also sheet 7
CODEC_I2S_MCLK: U301.N16(.BANK1:IOR_117) ; also sheet 7
CODEC_I2S_SCLK: U301.T16(.BANK2SPI:IOB_100) ; also sheet 7
CODEC_I2S_SDIN: U301.P15(.BANK1:IOR_112) ; also sheet 7
CODEC_I2S_SDOUT: U301.P16(.BANK1:IOR_113) ; also sheet 7
DSP_BB_I2S_LRCLK: U301.D15(.BANK1:IOR_157) ; also sheet 2
DSP_BB_I2S_SCLK: U301.E16(.BANK1:IOR_151) ; also sheet 2
DSP_BB_I2S_SDIN: U301.D16(.BANK1:IOR_153) ; also sheet 2
DSP_BB_I2S_SDOUT: U301.C16(.BANK1:IOR_161) ; also sheet 2
DSP_I2S_LRCLK: U301.M15(.BANK1:IOR_123) ; also sheet 2
DSP_I2S_MCLK: U301.K15(.BANK1:IOR_131) ; also sheet 2
DSP_I2S_SCLK: U301.L16(.BANK1:IOR_127) ; also sheet 2
DSP_I2S_SDIN: U301.M16(.BANK1:IOR_121) ; also sheet 2
DSP_I2S_SDOUT: U301.K16(.BANK1:IOR_133) ; also sheet 2
EXP_IO0: CON301.3 U301.E5(.BANK0:IOT_225)
EXP_IO1: CON301.4 U301.E4(.BANK3:IOL_1A)
EXP_IO2: CON301.5 U301.E3(.BANK3:IOL_6B)
EXP_IO3: CON301.6 U301.E2(.BANK3:IOL_7B)
EXP_IO4: CON301.7 U301.F3(.BANK3:IOL_8B)
EXP_IO5: CON301.8 U301.F2(.BANK3:IOL_9B)
EXP_IO6: CON301.9 U301.F1(.BANK3:IOL_10B)
EXP_IO7: CON301.10 U301.G2(.BANK3:IOL_11B)
EXP_IO8: CON301.11 U301.G1(.BANK3:IOL_13B_GBIN7)
EXP_IO9: CON301.12 U301.H2(.BANK3:IOL_12B)
EXP_IO10: CON301.13 U301.H1(.BANK3:IOL_14B)
EXP_IO11: CON301.14 U301.H3(.BANK3:IOL_9A)
EXP_IO12: CON301.15 U301.J1(.BANK3:IOL_15B)
EXP_IO13: CON301.16 U301.J2(.BANK3:IOL_15A)
EXP_IO14: CON301.17 U301.K1(.BANK3:IOL_16A)
EXP_IO15: CON301.18 U301.L1(.BANK3:IOL_17B)
EXP_IO16: CON301.23 U301.K3(.BANK3:IOL_16B)
EXP_IO17: CON301.24 U301.K4(.BANK3:IOL_18A)
EXP_IO18: CON301.25 U301.L4(.BANK3:IOL_17A)
EXP_IO19: CON301.26 U301.L3(.BANK3:IOL_19B)
EXP_IO20: CON301.27 U301.M1(.BANK3:IOL_18B)
EXP_IO21: CON301.28 U301.M2(.BANK3:IOL_20B)
EXP_IO22: CON301.29 U301.M3(.BANK3:IOL_22B)
EXP_IO23: CON301.30 U301.M4(.BANK3:IOL_24B)
EXP_IO24: CON301.31 U301.M5(.BANK3:IOL_25B)
EXP_IO25: CON301.32 U301.L5(.BANK3:IOL_23A)
EXP_IO26: CON301.33 U301.M6(.BANK3:IOL_22A)
EXP_IO27: CON301.34 U301.P4(.BANK2SPI:IOB_54)
EXP_IO28: CON301.35 U301.P5(.BANK2SPI:IOB_58)
EXP_IO29: CON301.36 U301.N6(.BANK2SPI:IOB_52)
EXP_IO30: CON301.37 U301.L6(.BANK3:IOL_19A)
EXP_IO31: CON301.38 U301.N7(.BANK2SPI:IOB_66)
FPGA_BLED: R304.1 U301.B16(.BANK1:IOR_165)
FPGA_CBSEL0: U301.K11(.BANK2SPI:CBSEL0/IOB_103) ; also sheet 1
FPGA_CBSEL1\: U301.P13(.BANK2SPI:CBSEL1/IOB_104) ; also sheet 1
FPGA_CDONE: U301.M10(.PWRCTRL:CDONE) ; also sheet 1
FPGA_CLK1: U301.C8(.BANK0:IOT_197_GBIN1) ; also sheet 9
FPGA_CLK2: U301.K9(.BANK2SPI:IOB_82_GBIN4) ; also sheet 9
FPGA_CLK3: U301.R9(.BANK2SPI:IOB_81_GBIN5) ; also sheet 9
FPGA_CLK4: U301.F7(.BANK0:IOT_198_GBIN0) ; also sheet 9
FPGA_GLED: R303.1 U301.A15(.BANK0:IOT_177)
FPGA_MEM_IO0: U301.C13(.BANK0:IOT_174) U302.5(MOSI/IO0)
FPGA_MEM_IO1: U301.E13(.BANK1:IOR_166) U302.2(MISO/IO1)
FPGA_MEM_IO2: U301.D14(.BANK1:IOR_167) U302.3(!WP!/IO2)
FPGA_MEM_IO3: U301.D13(.BANK0:IOT_170) U302.7(!HOLD!/IO3)
FPGA_MEM_SCK: U301.C14(.BANK0:IOT_168) U302.6(SCK)
FPGA_RLED: R302.1 U301.A16(.BANK0:IOT_176)
FPGA_SPI_SCK: U301.R11(.BANK2SPI:SCK/IOB_107) ; also sheet 1
FPGA_SPI_SDI: U301.P11(.BANK2SPI:SDI/IOB_106) ; also sheet 1
FPGA_SPI_SDO: U301.P12(.BANK2SPI:SDO/IOB_105) ; also sheet 1
FPGA_VPP_FAST: TP3.TP U301.D12(.PWRCTRL:VPP_FAST)
GND: C301.2(C2) C302.2(C2) C303.2(C2) C304.2(C2) C305.2(C2) C306.2(C2) C307.2(C2) C308.2(C2) C309.2(C2) C310.2(C2) C311.2(C2) C312.2(C2) C313.2(C2) C314.2(C2) C315.2(C2) C316.2(C2) C317.2(C2) C318.2(C2) C319.2(C2) CON301.2 CON301.19 CON301.22 CON301.39 D301.4(B:C) D301.5(R:C) D301.6(G:C) R301.1 U301.A4(.PWRCTRL:GND) U301.A12(.PWRCTRL:GND) U301.E7(.PWRCTRL:GNDPLL1) U301.E15(.PWRCTRL:GND) U301.G7(.PWRCTRL:GND) U301.G8(.PWRCTRL:GND) U301.G9(.PWRCTRL:GND) U301.H7(.PWRCTRL:GND) U301.H8(.PWRCTRL:GND) U301.H9(.PWRCTRL:GND) U301.J7(.PWRCTRL:GND) U301.J8(.PWRCTRL:GND) U301.J9(.PWRCTRL:GND) U301.K2(.PWRCTRL:GND) U301.K7(.PWRCTRL:GND) U301.L15(.PWRCTRL:GND) U301.N8(.PWRCTRL:GNDPLL0) U301.R7(.PWRCTRL:GND) U301.T4(.PWRCTRL:GND) U301.T12(.PWRCTRL:GND) U302.4(GND) ; also sheet 1,2,4,5,6,7,8,9,10
N$141: D301.2(R:A) R302.2
N$142: D301.1(G:A) R303.2
N$143: D301.3(B:A) R304.2
RXADC_CLK: U301.P1(.BANK3:IOL_24A) ; also sheet 4
RXADC_D0: U301.T11(.BANK2SPI:IOB_89) ; also sheet 4
RXADC_D1: U301.R10(.BANK2SPI:IOB_84) ; also sheet 4
RXADC_D2: U301.T10(.BANK2SPI:IOB_88) ; also sheet 4
RXADC_D3: U301.T9(.BANK2SPI:IOB_79) ; also sheet 4
RXADC_D4: U301.T8(.BANK2SPI:IOB_76) ; also sheet 4
RXADC_D5: U301.T7(.BANK2SPI:IOB_75) ; also sheet 4
RXADC_D6: U301.R6(.BANK2SPI:IOB_71) ; also sheet 4
RXADC_D7: U301.T6(.BANK2SPI:IOB_73) ; also sheet 4
RXADC_D8: U301.R5(.BANK2SPI:IOB_60) ; also sheet 4
RXADC_D9: U301.T5(.BANK2SPI:IOB_69) ; also sheet 4
RXADC_D10: U301.R4(.BANK2SPI:IOB_63) ; also sheet 4
RXADC_D11: U301.R3(.BANK2SPI:IOB_59) ; also sheet 4
RXADC_D12: U301.T3(.BANK2SPI:IOB_61) ; also sheet 4
RXADC_D13: U301.R2(.BANK2SPI:IOB_55) ; also sheet 4
RXADC_D14: U301.T2(.BANK2SPI:IOB_57) ; also sheet 4
RXADC_D15: U301.T1(.BANK2SPI:IOB_53) ; also sheet 4
RXADC_OF: U301.R1(.BANK3:IOL_26A) ; also sheet 4
TXDAC_CLKIN: U301.D2(.BANK3:IOL_4B) ; also sheet 5
TXDAC_D0: U301.A7(.BANK0:IOT_205) ; also sheet 5
TXDAC_D1: U301.B7(.BANK0:IOT_207) ; also sheet 5
TXDAC_D2: U301.A6(.BANK0:IOT_211) ; also sheet 5
TXDAC_D3: U301.B6(.BANK0:IOT_208) ; also sheet 5
TXDAC_D4: U301.A5(.BANK0:IOT_213) ; also sheet 5
TXDAC_D5: U301.B5(.BANK0:IOT_214) ; also sheet 5
TXDAC_D6: U301.B4(.BANK0:IOT_216) ; also sheet 5
TXDAC_D7: U301.B3(.BANK0:IOT_223) ; also sheet 5
TXDAC_D8: U301.A2(.BANK0:IOT_218) ; also sheet 5
TXDAC_D9: U301.B2(.BANK3:IOL_1B) ; also sheet 5
TXDAC_D10: U301.A1(.BANK0:IOT_220) ; also sheet 5
TXDAC_D11: U301.B1(.BANK3:IOL_2B) ; also sheet 5
TXDAC_D12: U301.C2(.BANK3:IOL_3B) ; also sheet 5
TXDAC_D13: U301.C1(.BANK3:IOL_3A) ; also sheet 5
TXDAC_DCLK: U301.D1(.BANK3:IOL_5B) ; also sheet 5
Unconnected: U301.A9(.BANK0:IOT_194) U301.A10(.BANK0:IOT_186) U301.A11(.BANK0:IOT_187) U301.B8(.BANK0:IOT_203) U301.B9(.BANK0:IOT_199) U301.B10(.BANK0:IOT_183) U301.B11(.BANK0:IOT_184) U301.B12(.BANK0:IOT_182) U301.B13(.BANK0:IOT_178) U301.B14(.BANK0:IOT_171) U301.B15(.BANK0:IOT_169) U301.C3(.BANK0:IOT_227) U301.C4(.BANK0:IOT_222) U301.C5(.BANK0:IOT_221) U301.C6(.BANK0:IOT_209) U301.C7(.BANK0:IOT_206) U301.C9(.BANK0:IOT_191) U301.C10(.BANK0:IOT_185) U301.C11(.BANK0:IOT_180) U301.C12(.BANK0:IOT_172) U301.D3(.BANK0:IOT_226) U301.D4(.BANK0:IOT_224) U301.D5(.BANK0:IOT_219) U301.D6(.BANK0:IOT_212) U301.D7(.BANK0:IOT_210) U301.D8(.BANK0:IOT_200) U301.D9(.BANK0:IOT_193) U301.D10(.BANK0:IOT_190) U301.D11(.BANK0:IOT_181) U301.E6(.BANK0:IOT_215) U301.E9(.BANK0:IOT_192) U301.E10(.BANK0:IOT_179) U301.E11(.BANK0:IOT_173) U301.F4(.BANK3:IOL_4A) U301.F5(.BANK3:IOL_2A) U301.F9(.BANK0:IOT_196) U301.F11(.BANK1:IOR_158) U301.F12(.BANK1:IOR_156) U301.F13(.BANK1:IOR_162) U301.F14(.BANK1:IOR_155) U301.F15(.BANK1:IOR_149) U301.G3(.BANK3:IOL_8A) U301.G4(.BANK3:IOL_6A) U301.G5(.BANK3:IOL_5A) U301.G10(.BANK1:IOR_146) U301.G11(.BANK1:IOR_148) U301.G12(.BANK1:IOR_154) U301.G13(.BANK1:IOR_152) U301.G14(.BANK1:IOR_150) U301.G15(.BANK1:IOR_145) U301.G16(.BANK1:IOR_143) U301.H4(.BANK3:IOL_11A) U301.H5(.BANK3:IOL_7A) U301.H6(.BANK3:IOL_10A) U301.H11(.BANK1:IOR_140_GBIN3) U301.H12(.BANK1:IOR_144) U301.H13(.BANK1:IOR_139) U301.H14(.BANK1:IOR_142) U301.J3(.BANK3:IOL_14A_GBIN6) U301.J4(.BANK3:IOL_12A) U301.J5(.BANK3:IOL_13A) U301.J10(.BANK1:IOR_122) U301.J11(.BANK1:IOR_126) U301.J12(.BANK1:IOR_136) U301.J13(.BANK1:IOR_137) U301.J14(.BANK1:IOR_134) U301.J15(.BANK1:IOR_130) U301.J16(.BANK1:IOR_138) U301.K5(.BANK3:IOL_20A) U301.K12(.BANK1:IOR_120) U301.K13(.BANK1:IOR_128) U301.K14(.BANK1:IOR_129) U301.L7(.BANK3:IOL_21A) U301.L9(.BANK2SPI:IOB_74) U301.L10(.BANK2SPI:IOB_85) U301.L11(.BANK2SPI:IOB_99) U301.L12(.BANK1:IOR_116) U301.L13(.BANK1:IOR_118) U301.L14(.BANK1:IOR_119) U301.M7(.BANK2SPI:IOB_64) U301.M8(.BANK2SPI:IOB_68) U301.M9(.BANK2SPI:IOB_80) U301.M11(.BANK2SPI:IOB_93) U301.M12(.BANK2SPI:IOB_101) U301.M13(.BANK1:IOR_114) U301.M14(.BANK1:IOR_115) U301.N2(.BANK3:IOL_21B) U301.N3(.BANK3:IOL_23B) U301.N4(.BANK3:IOL_26B) U301.N5(.BANK2SPI:IOB_56) U301.N9(.BANK2SPI:IOB_78) U301.N10(.BANK2SPI:IOB_87) U301.N12(.BANK2SPI:IOB_98) U301.P6(.BANK2SPI:IOB_67) U301.P7(.BANK2SPI:IOB_77) U301.P8(.BANK2SPI:IOB_72) U301.P9(.BANK2SPI:IOB_83) U301.P10(.BANK2SPI:IOB_86) U301.P14(.BANK1:IOR_111)

## Sheet 4 of 10: RX Tumer + RX IF ADC
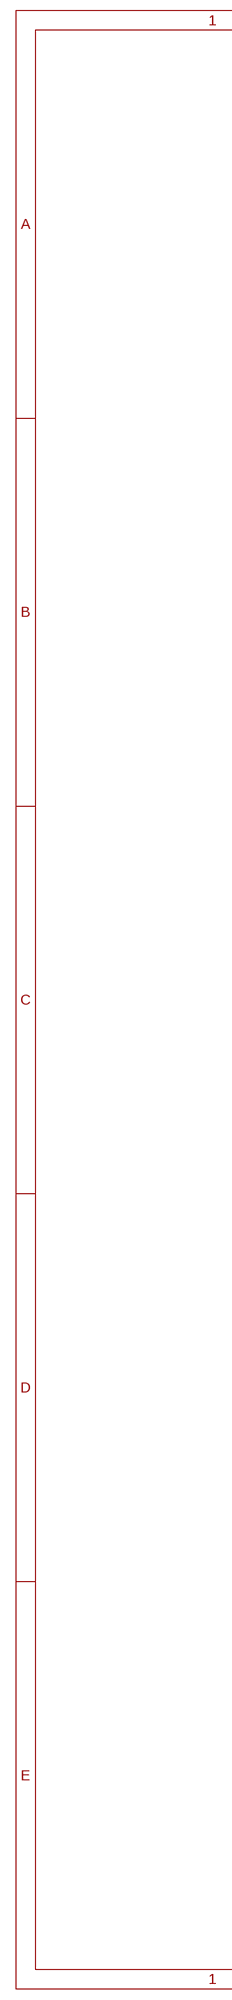
[diagram p6: schematic, sheet 4, part 1 of 2]
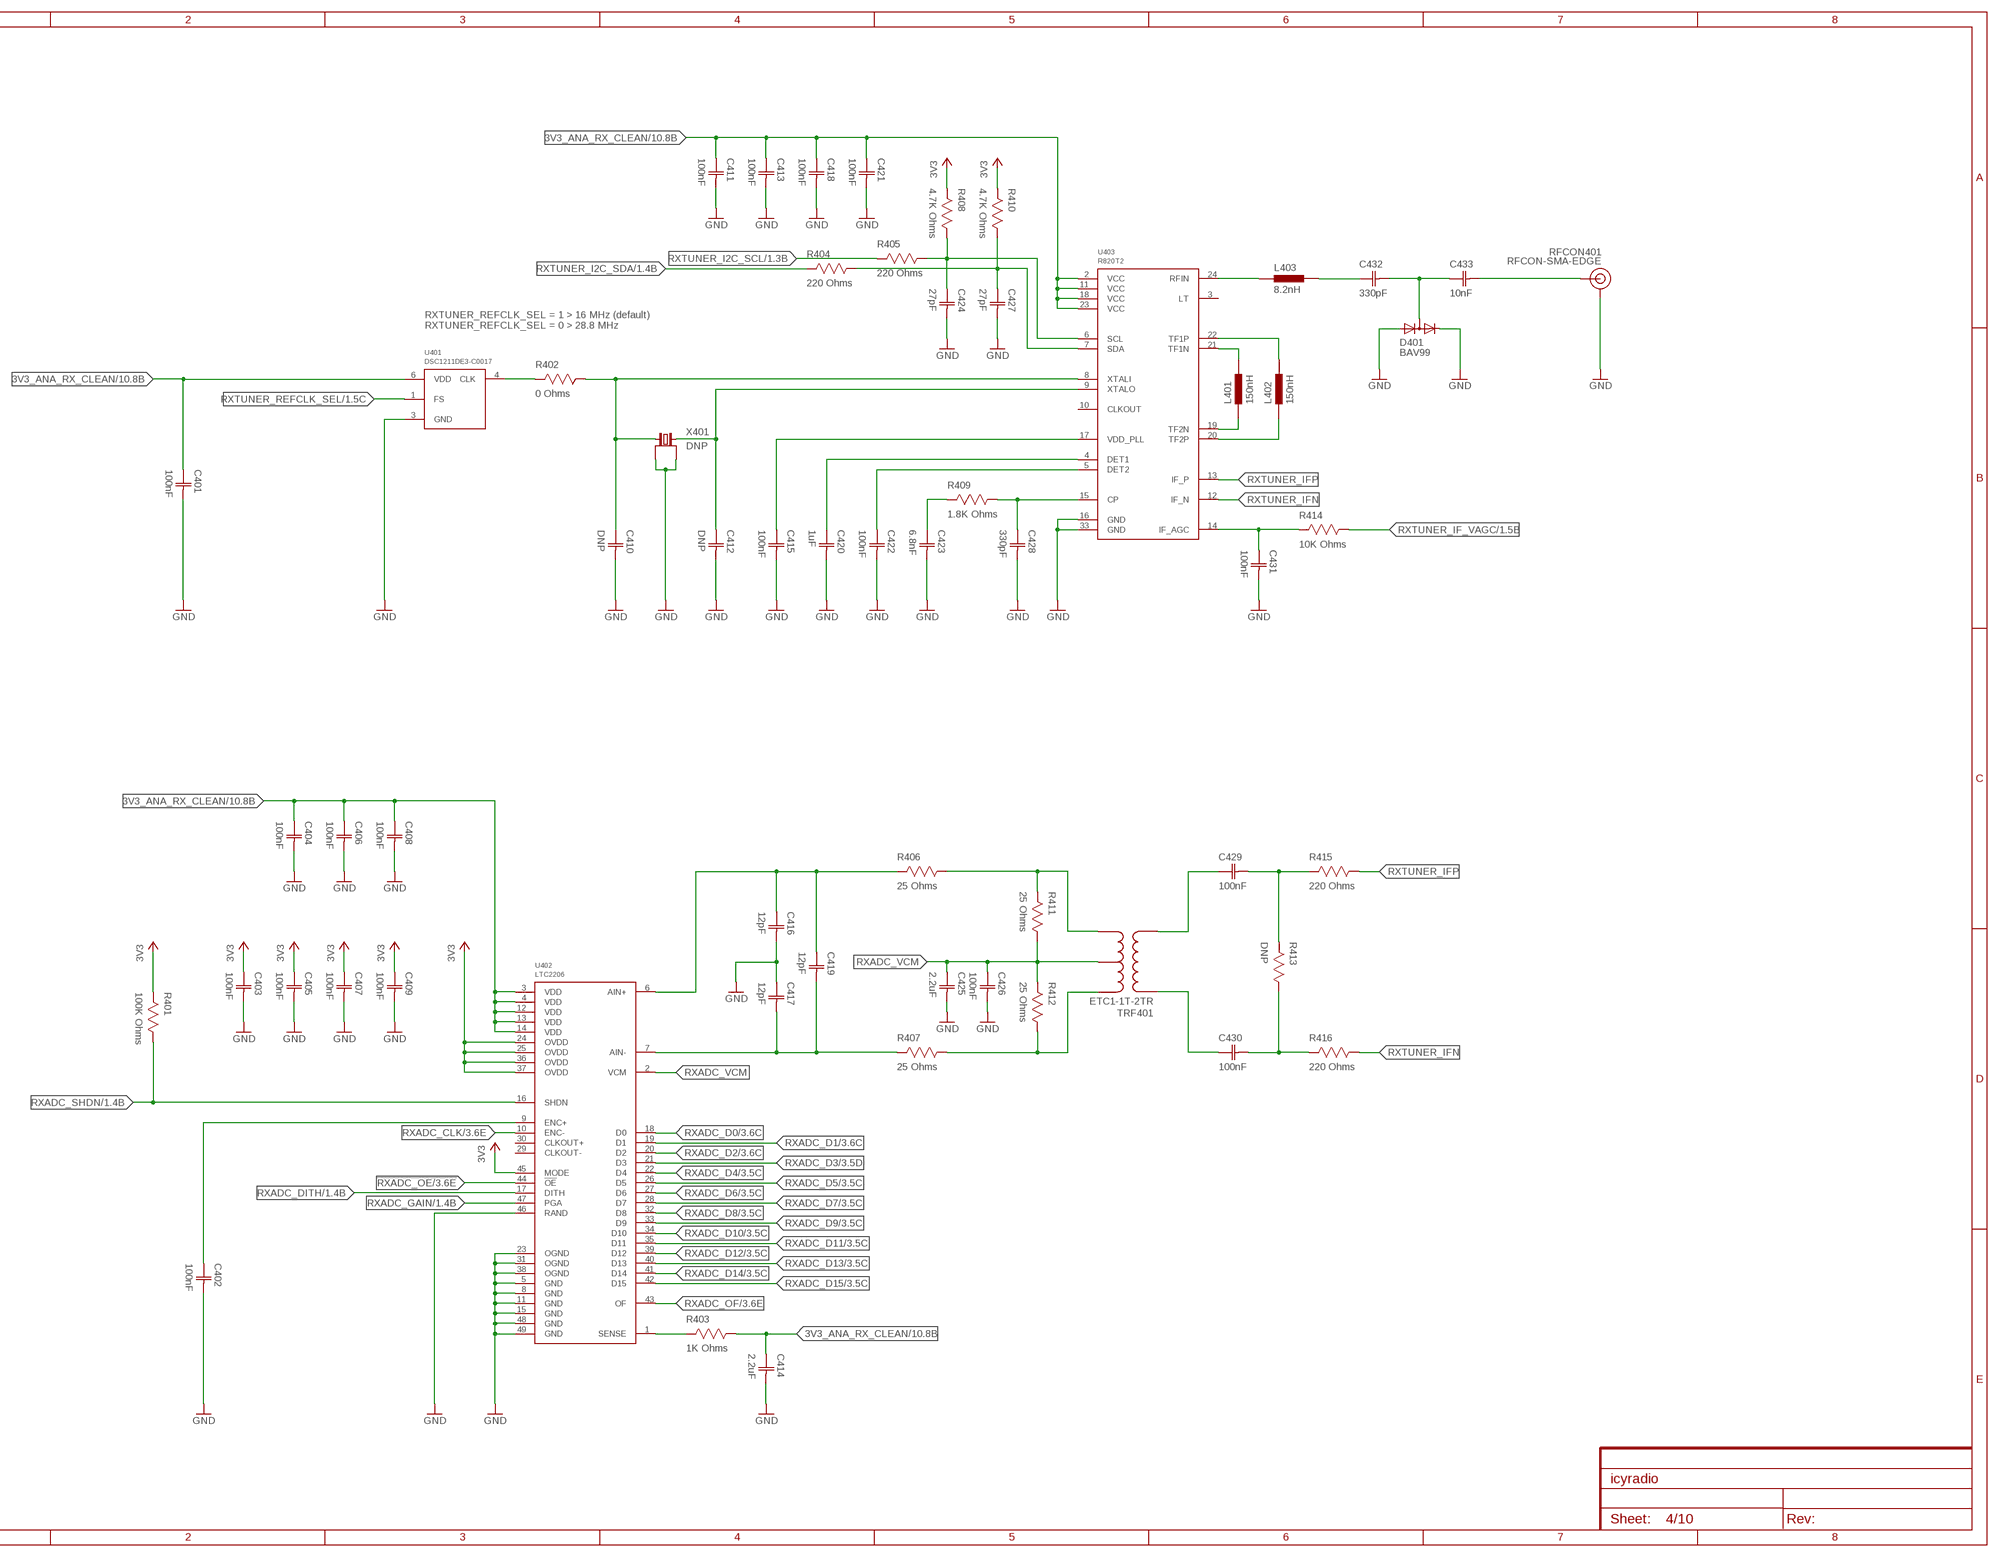
[diagram p7: schematic, sheet 4, part 2 of 2]

### Parts
C401  100nF  CAPACITOR-0603  [CAP0603]
C402  100nF  CAPACITOR-0603  [CAP0603]
C403  100nF  CAPACITOR-0603  [CAP0603]
C404  100nF  CAPACITOR-0603  [CAP0603]
C405  100nF  CAPACITOR-0603  [CAP0603]
C406  100nF  CAPACITOR-0603  [CAP0603]
C407  100nF  CAPACITOR-0603  [CAP0603]
C408  100nF  CAPACITOR-0603  [CAP0603]
C409  100nF  CAPACITOR-0603  [CAP0603]
C410  DNP  CAPACITOR-0603  [CAP0603]
C411  100nF  CAPACITOR-0603  [CAP0603]
C412  DNP  CAPACITOR-0603  [CAP0603]
C413  100nF  CAPACITOR-0603  [CAP0603]
C414  2.2uF  CAPACITOR-0603  [CAP0603]
C415  100nF  CAPACITOR-0603  [CAP0603]
C416  12pF  CAPACITOR-0603  [CAP0603]
C417  12pF  CAPACITOR-0603  [CAP0603]
C418  100nF  CAPACITOR-0603  [CAP0603]
C419  12pF  CAPACITOR-0603  [CAP0603]
C420  1uF  CAPACITOR-0603  [CAP0603]
C421  100nF  CAPACITOR-0603  [CAP0603]
C422  100nF  CAPACITOR-0603  [CAP0603]
C423  6.8nF  CAPACITOR-0603  [CAP0603]
C424  27pF  CAPACITOR-0603  [CAP0603]
C425  2.2uF  CAPACITOR-0603  [CAP0603]
C426  100nF  CAPACITOR-0603  [CAP0603]
C427  27pF  CAPACITOR-0603  [CAP0603]
C428  330pF  CAPACITOR-0603  [CAP0603]
C429  100nF  CAPACITOR-0603  [CAP0603]
C430  100nF  CAPACITOR-0603  [CAP0603]
C431  100nF  CAPACITOR-0603  [CAP0603]
C432  330pF  CAPACITOR-0603  [CAP0603]
C433  10nF  CAPACITOR-0603  [CAP0603]
D401  BAV99  [SOT23]
L401  150nH  INDUCTOR-0603  [IND0603]
L402  150nH  INDUCTOR-0603  [IND0603]
L403  8.2nH  INDUCTOR-0603  [IND0603]
R401  100K Ohms  RESISTOR-0603  [RES0603]
R402  0 Ohms  RESISTOR-0603  [RES0603]
R403  1K Ohms  RESISTOR-0603  [RES0603]
R404  220 Ohms  RESISTOR-0603  [RES0603]
R405  220 Ohms  RESISTOR-0603  [RES0603]
R406  25 Ohms  RESISTOR-0603  [RES0603]
R407  25 Ohms  RESISTOR-0603  [RES0603]
R408  4.7K Ohms  RESISTOR-0603  [RES0603]
R409  1.8K Ohms  RESISTOR-0603  [RES0603]
R410  4.7K Ohms  RESISTOR-0603  [RES0603]
R411  25 Ohms  RESISTOR-0603  [RES0603]
R412  25 Ohms  RESISTOR-0603  [RES0603]
R413  DNP  RESISTOR-0603  [RES0603]
R414  10K Ohms  RESISTOR-0603  [RES0603]
R415  220 Ohms  RESISTOR-0603  [RES0603]
R416  220 Ohms  RESISTOR-0603  [RES0603]
RFCON401  RFCON-SMA-EDGE  [SMA-EDGE]
TRF401  ETC1-1T-2TR  [TRF-SM-22]
U401  DSC1211DE3-C0017  [VDFN6]
U402  LTC2206  [QFN48]
U403  R820T2  [QFN24]
X401  DNP  CRYSTAL_4P  [4-SMD-3225]

### Nets
3V3: C403.1(C1) C405.1(C1) C407.1(C1) C409.1(C1) R401.2 R408.2 R410.2 U402.24(OVDD) U402.25(OVDD) U402.36(OVDD) U402.37(OVDD) U402.45(MODE) ; also sheet 1,2,3,5,6,7,8,9,10
3V3_ANA_RX_CLEAN: C401.1(C1) C404.1(C1) C406.1(C1) C408.1(C1) C411.1(C1) C413.1(C1) C414.1(C1) C418.1(C1) C421.1(C1) R403.1 U401.6(VDD) U402.3(VDD) U402.4(VDD) U402.12(VDD) U402.13(VDD) U402.14(VDD) U403.2(VCC) U403.11(VCC) U403.18(VCC) U403.23(VCC) ; also sheet 10
!RXADC_OE: U402.44(!OE) ; also sheet 3
GND: C401.2(C2) C402.2(C2) C403.2(C2) C404.2(C2) C405.2(C2) C406.2(C2) C407.2(C2) C408.2(C2) C409.2(C2) C410.2(C2) C411.2(C2) C412.2(C2) C413.2(C2) C414.2(C2) C415.2(C2) C416.2(C2) C417.1(C1) C418.2(C2) C420.2(C2) C421.2(C2) C422.2(C2) C423.2(C2) C424.2(C2) C425.2(C2) C426.2(C2) C427.2(C2) C428.2(C2) C431.2(C2) D401.1(A) D401.2(C) RFCON401.GND@0(GND) RFCON401.GND@1(GND) RFCON401.GND@2(GND) RFCON401.GND@3(GND) U401.3(GND) U402.5(GND) U402.8(GND) U402.11(GND) U402.15(GND) U402.23(OGND) U402.31(OGND) U402.38(OGND) U402.46(RAND) U402.48(GND) U402.49(GND) U403.16(GND) U403.33(GND) X401.1(GND) X401.3(GND) ; also sheet 1,2,3,5,6,7,8,9,10
N$3: R407.1 R412.1 TRF401.3(SEC1)
N$4: C430.1(C1) TRF401.4(PRI1)
N$5: R406.1 R411.2 TRF401.1(SEC2)
N$8: C429.1(C1) TRF401.5(PRI2)
N$9: C430.2(C2) R413.1 R416.2
N$10: C429.2(C2) R413.2 R415.2
N$15: C433.2(C2) RFCON401.SIG(SIGNAL)
N$16: C432.2(C2) C433.1(C1) D401.3(MID)
N$17: C432.1(C1) L403.2
N$18: L403.1 U403.24(RFIN)
N$20: C424.1(C1) R405.1 R408.1 U403.6(SCL)
N$21: C427.1(C1) R404.1 R410.1 U403.7(SDA)
N$22: C423.1(C1) R409.2
N$26: R402.2 U401.4(CLK)
N$27: C431.1(C1) R414.2 U403.14(IF_AGC)
RXADC_AIN+: C416.1(C1) C419.1(C1) R406.2 U402.6(AIN+)
RXADC_AIN-: C417.2(C2) C419.2(C2) R407.2 U402.7(AIN-)
RXADC_CLK: U402.10(ENC-) ; also sheet 3
RXADC_D0: U402.18(D0) ; also sheet 3
RXADC_D1: U402.19(D1) ; also sheet 3
RXADC_D2: U402.20(D2) ; also sheet 3
RXADC_D3: U402.21(D3) ; also sheet 3
RXADC_D4: U402.22(D4) ; also sheet 3
RXADC_D5: U402.26(D5) ; also sheet 3
RXADC_D6: U402.27(D6) ; also sheet 3
RXADC_D7: U402.28(D7) ; also sheet 3
RXADC_D8: U402.32(D8) ; also sheet 3
RXADC_D9: U402.33(D9) ; also sheet 3
RXADC_D10: U402.34(D10) ; also sheet 3
RXADC_D11: U402.35(D11) ; also sheet 3
RXADC_D12: U402.39(D12) ; also sheet 3
RXADC_D13: U402.40(D13) ; also sheet 3
RXADC_D14: U402.41(D14) ; also sheet 3
RXADC_D15: U402.42(D15) ; also sheet 3
RXADC_DITH: U402.17(DITH) ; also sheet 1
RXADC_ENC+: C402.1(C1) U402.9(ENC+)
RXADC_GAIN: U402.47(PGA) ; also sheet 1
RXADC_OF: U402.43(OF) ; also sheet 3
RXADC_SENSE: R403.2 U402.1(SENSE)
RXADC_SHDN: R401.1 U402.16(SHDN) ; also sheet 1
RXADC_VCM: C425.1(C1) C426.1(C1) R411.1 R412.2 TRF401.2(CT) U402.2(VCM)
RXTUNER_DET1: C420.1(C1) U403.4(DET1)
RXTUNER_DET2: C422.1(C1) U403.5(DET2)
RXTUNER_I2C_SCL: R405.2 ; also sheet 1
RXTUNER_I2C_SDA: R404.2 ; also sheet 1
RXTUNER_IF_VAGC: R414.1 ; also sheet 1
RXTUNER_IFN: R416.1 U403.12(IF_N)
RXTUNER_IFP: R415.1 U403.13(IF_P)
RXTUNER_PLL_CP: C428.1(C1) R409.1 U403.15(CP)
RXTUNER_REFCLK_SEL: U401.1(FS) ; also sheet 1
RXTUNER_TF1N: L401.2 U403.21(TF1N)
RXTUNER_TF1P: L402.2 U403.22(TF1P)
RXTUNER_TF2N: L401.1 U403.19(TF2N)
RXTUNER_TF2P: L402.1 U403.20(TF2P)
RXTUNER_VDD_PLL: C415.1(C1) U403.17(VDD_PLL)
RXTUNER_XTALI: C410.1(C1) R402.1 U403.8(XTALI) X401.2
RXTUNER_XTALO: C412.1(C1) U403.9(XTALO) X401.4
Unconnected: U402.29(CLKOUT-) U402.30(CLKOUT+) U403.3(LT) U403.10(CLKOUT)

### Notes on the sheet
- RXTUNER_REFCLK_SEL = 1 > 16 MHz (default)
  RXTUNER_REFCLK_SEL = 0 > 28.8 MHz

## Sheet 5 of 10: TX BB DAC + Upconverting Mixer
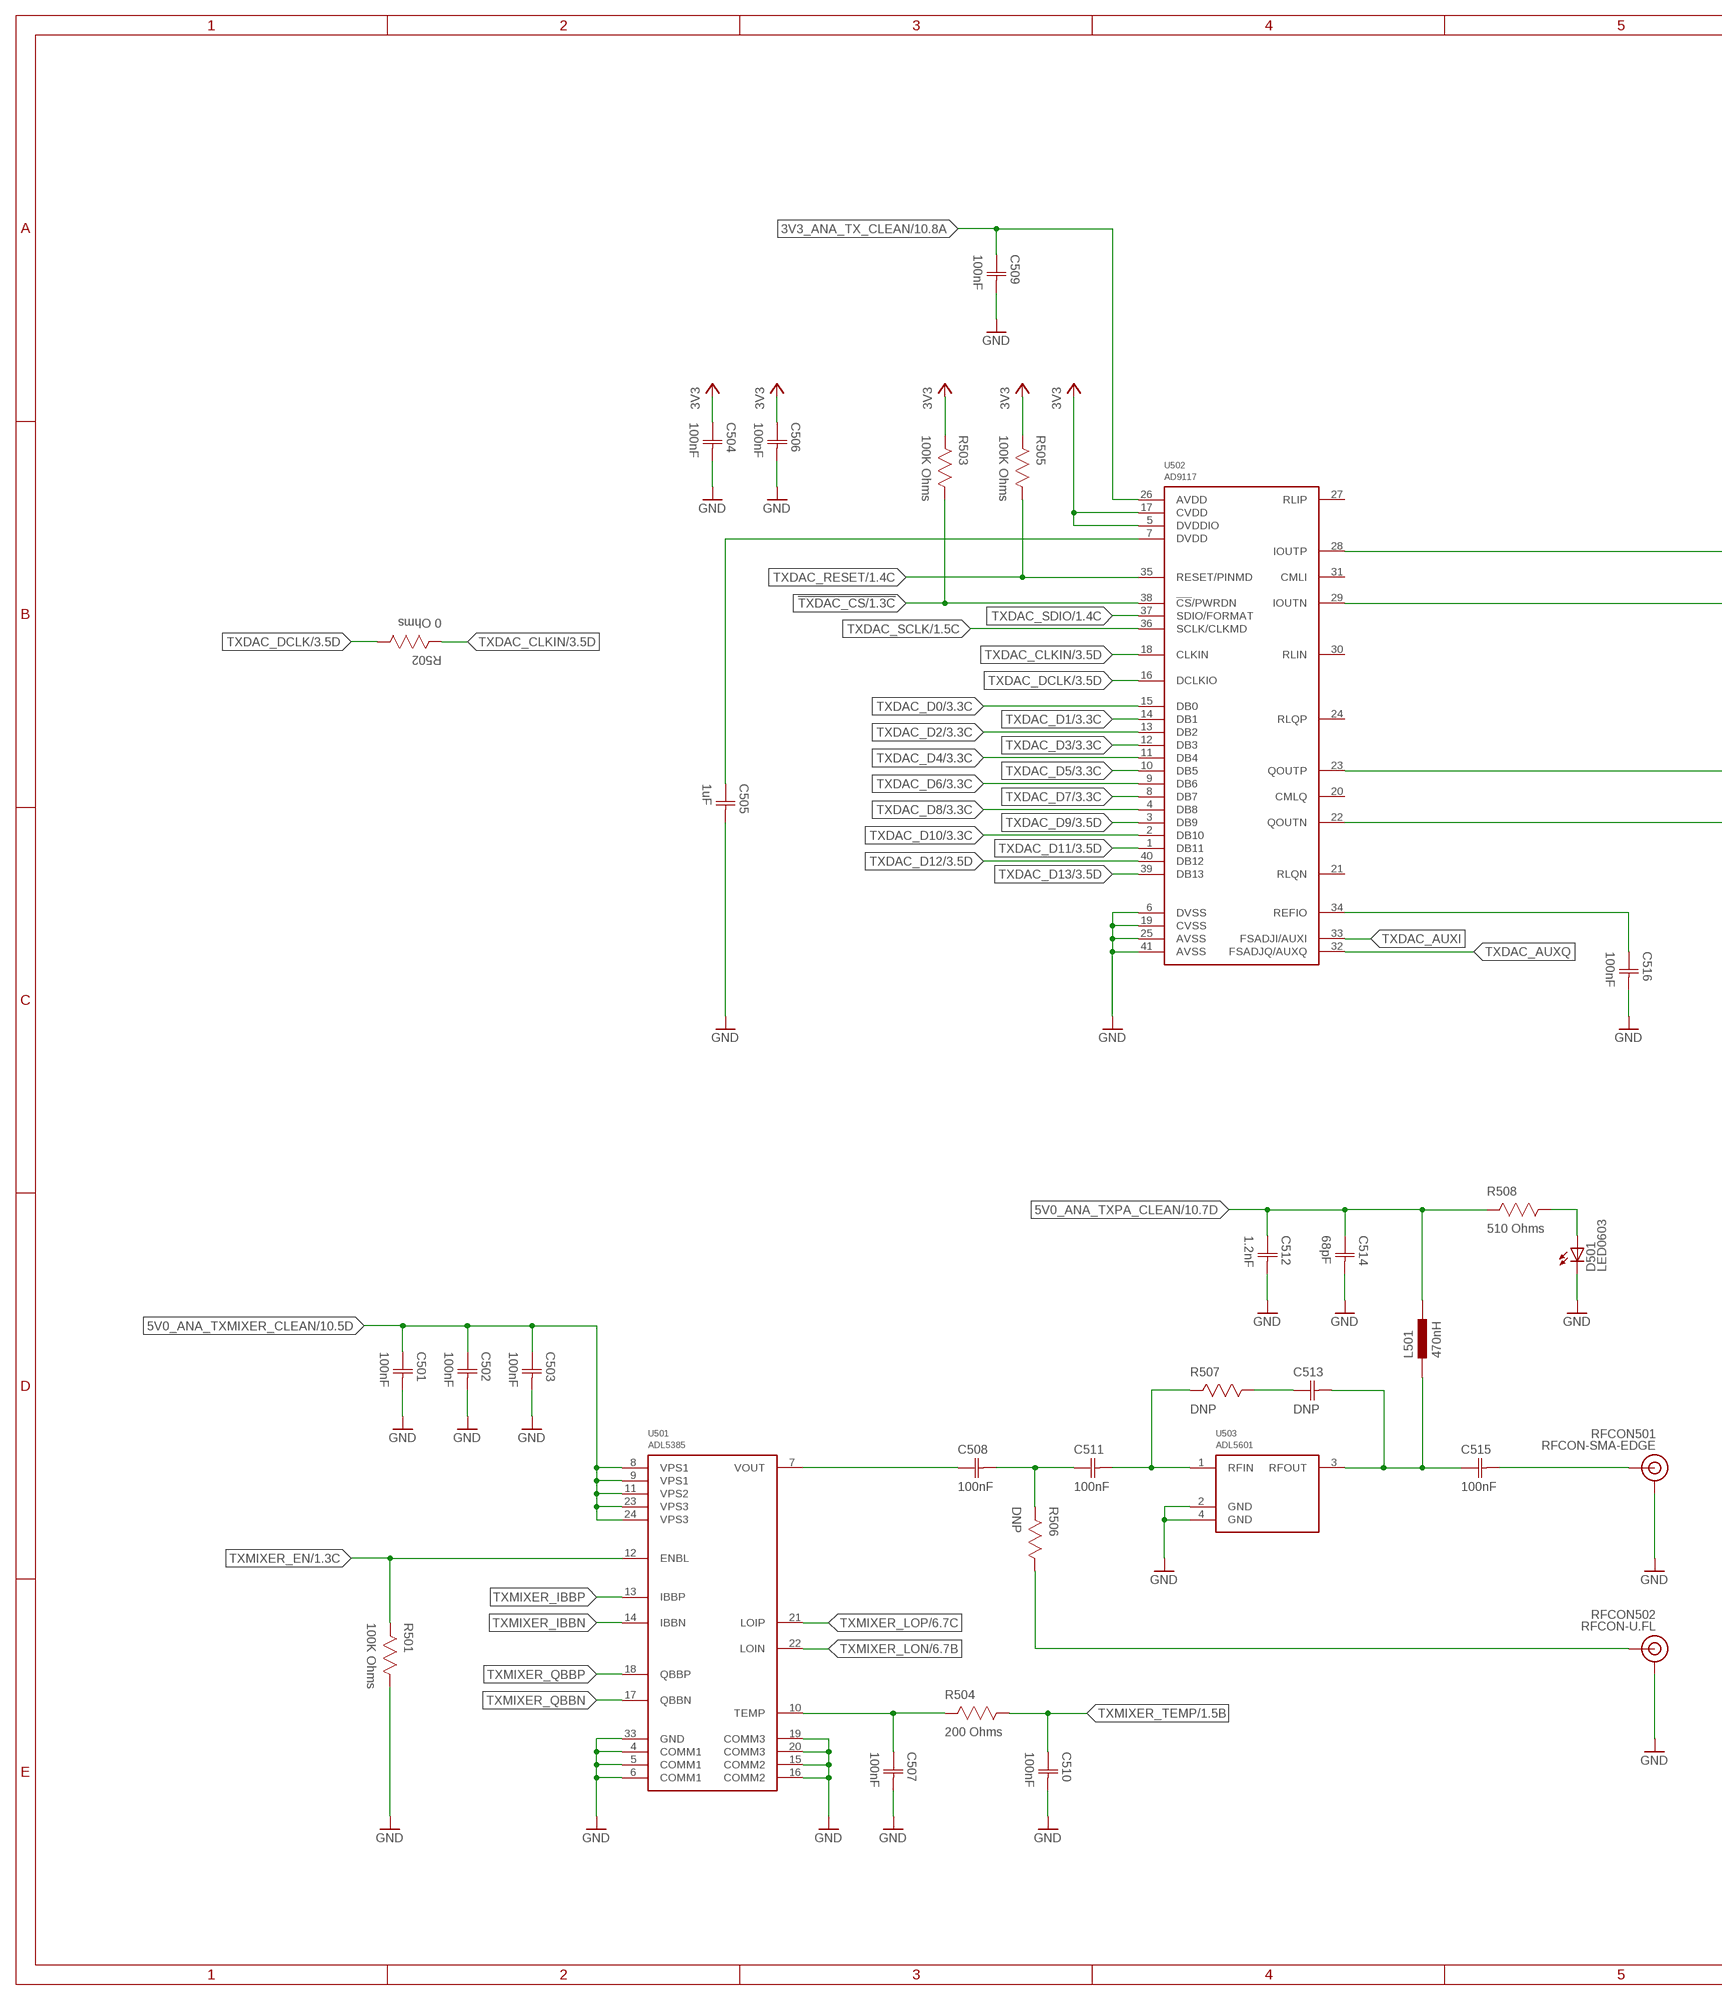
[diagram p8: schematic, sheet 5, part 1 of 2]
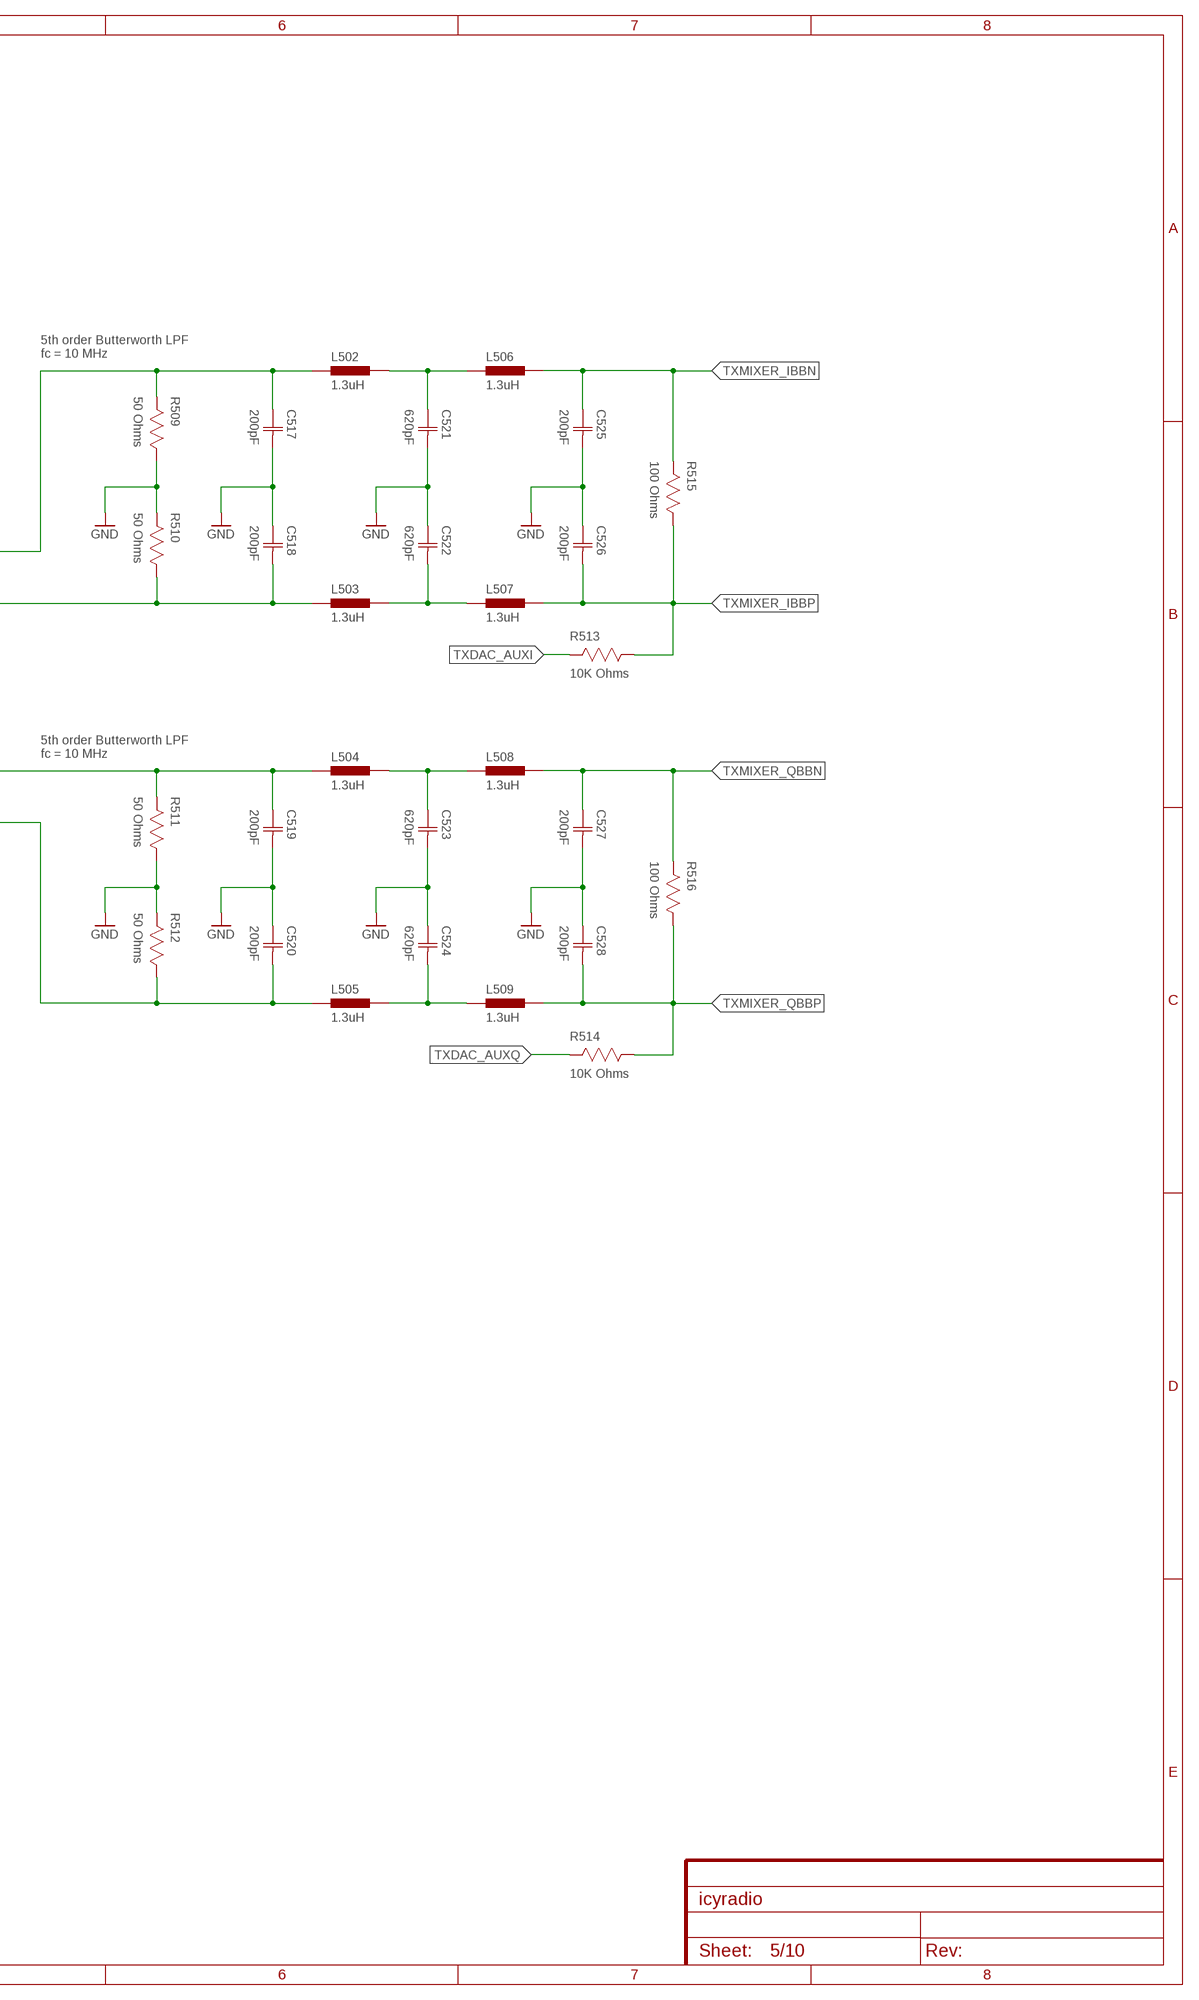
[diagram p9: schematic, sheet 5, part 2 of 2]

### Parts
C501  100nF  CAPACITOR-0603  [CAP0603]
C502  100nF  CAPACITOR-0603  [CAP0603]
C503  100nF  CAPACITOR-0603  [CAP0603]
C504  100nF  CAPACITOR-0603  [CAP0603]
C505  1uF  CAPACITOR-0603  [CAP0603]
C506  100nF  CAPACITOR-0603  [CAP0603]
C507  100nF  CAPACITOR-0603  [CAP0603]
C508  100nF  CAPACITOR-0603  [CAP0603]
C509  100nF  CAPACITOR-0603  [CAP0603]
C510  100nF  CAPACITOR-0603  [CAP0603]
C511  100nF  CAPACITOR-0603  [CAP0603]
C512  1.2nF  CAPACITOR-0603  [CAP0603]
C513  DNP  CAPACITOR-0603  [CAP0603]
C514  68pF  CAPACITOR-0603  [CAP0603]
C515  100nF  CAPACITOR-0603  [CAP0603]
C516  100nF  CAPACITOR-0603  [CAP0603]
C517  200pF  CAPACITOR-0603  [CAP0603]
C518  200pF  CAPACITOR-0603  [CAP0603]
C519  200pF  CAPACITOR-0603  [CAP0603]
C520  200pF  CAPACITOR-0603  [CAP0603]
C521  620pF  CAPACITOR-0603  [CAP0603]
C522  620pF  CAPACITOR-0603  [CAP0603]
C523  620pF  CAPACITOR-0603  [CAP0603]
C524  620pF  CAPACITOR-0603  [CAP0603]
C525  200pF  CAPACITOR-0603  [CAP0603]
C526  200pF  CAPACITOR-0603  [CAP0603]
C527  200pF  CAPACITOR-0603  [CAP0603]
C528  200pF  CAPACITOR-0603  [CAP0603]
D501  LED0603  [0603]
L501  470nH  INDUCTOR-0603  [IND0603]
L502  1.3uH  INDUCTOR-0603  [IND0603]
L503  1.3uH  INDUCTOR-0603  [IND0603]
L504  1.3uH  INDUCTOR-0603  [IND0603]
L505  1.3uH  INDUCTOR-0603  [IND0603]
L506  1.3uH  INDUCTOR-0603  [IND0603]
L507  1.3uH  INDUCTOR-0603  [IND0603]
L508  1.3uH  INDUCTOR-0603  [IND0603]
L509  1.3uH  INDUCTOR-0603  [IND0603]
R501  100K Ohms  RESISTOR-0603  [RES0603]
R502  0 Ohms  RESISTOR-0603  [RES0603]
R503  100K Ohms  RESISTOR-0603  [RES0603]
R504  200 Ohms  RESISTOR-0603  [RES0603]
R505  100K Ohms  RESISTOR-0603  [RES0603]
R506  DNP  RESISTOR-0603  [RES0603]
R507  DNP  RESISTOR-0603  [RES0603]
R508  510 Ohms  RESISTOR-0603  [RES0603]
R509  50 Ohms  RESISTOR-0603  [RES0603]
R510  50 Ohms  RESISTOR-0603  [RES0603]
R511  50 Ohms  RESISTOR-0603  [RES0603]
R512  50 Ohms  RESISTOR-0603  [RES0603]
R513  10K Ohms  RESISTOR-0603  [RES0603]
R514  10K Ohms  RESISTOR-0603  [RES0603]
R515  100 Ohms  RESISTOR-0603  [RES0603]
R516  100 Ohms  RESISTOR-0603  [RES0603]
RFCON501  RFCON-SMA-EDGE  [SMA-EDGE]
RFCON502  RFCON-U.FL  [U.FL]
U501  ADL5385  [QFN24]
U502  AD9117  [QFN40]
U503  ADL5601  [SOT89]

### Nets
3V3: C504.1(C1) C506.1(C1) R503.2 R505.2 U502.5(DVDDIO) U502.17(CVDD) ; also sheet 1,2,3,4,6,7,8,9,10
3V3_ANA_TX_CLEAN: C509.1(C1) U502.26(AVDD) ; also sheet 10
5V0_ANA_TXMIXER_CLEAN: C501.1(C1) C502.1(C1) C503.1(C1) U501.8(VPS1) U501.9(VPS1) U501.11(VPS2) U501.23(VPS3) U501.24(VPS3) ; also sheet 10
5V0_ANA_TXPA_CLEAN: C512.1(C1) C514.1(C1) L501.2 R508.2 ; also sheet 10
!TXDAC_CS: R503.1 U502.38(!CS!/PWRDN) ; also sheet 1
GND: C501.2(C2) C502.2(C2) C503.2(C2) C504.2(C2) C505.2(C2) C506.2(C2) C507.2(C2) C509.2(C2) C510.2(C2) C512.2(C2) C514.2(C2) C516.2(C2) C517.2(C2) C518.1(C1) C519.2(C2) C520.1(C1) C521.2(C2) C522.1(C1) C523.2(C2) C524.1(C1) C525.2(C2) C526.1(C1) C527.2(C2) C528.1(C1) D501.1(C) R501.1 R509.1 R510.2 R511.1 R512.2 RFCON501.GND@0(GND) RFCON501.GND@1(GND) RFCON501.GND@2(GND) RFCON501.GND@3(GND) RFCON502.P$1(GND) RFCON502.P$2(GND) U501.4(COMM1) U501.5(COMM1) U501.6(COMM1) U501.15(COMM2) U501.16(COMM2) U501.19(COMM3) U501.20(COMM3) U501.33(GND) U502.6(DVSS) U502.19(CVSS) U502.25(AVSS) U502.41(AVSS) U503.2(GND) U503.4(GND) ; also sheet 1,2,3,4,6,7,8,9,10
N$6: C508.2(C2) C511.1(C1) R506.2
N$23: C507.1(C1) R504.2 U501.10(TEMP)
N$63: C515.2(C2) RFCON501.SIG(SIGNAL)
N$64: C508.1(C1) U501.7(VOUT)
N$73: C518.2(C2) L503.1 R510.1 U502.29(IOUTN)
N$74: C517.1(C1) L502.1 R509.2 U502.28(IOUTP)
N$75: C522.2(C2) L503.2 L507.1
N$76: C521.1(C1) L502.2 L506.1
N$77: C505.1(C1) U502.7(DVDD)
N$80: C520.2(C2) L505.1 R512.1 U502.22(QOUTN)
N$81: C519.1(C1) L504.1 R511.2 U502.23(QOUTP)
N$82: C524.2(C2) L505.2 L509.1
N$83: C523.1(C1) L504.2 L508.1
N$92: C513.1(C1) R507.1
N$137: C516.1(C1) U502.34(REFIO)
N$146: D501.2(A) R508.1
TXDAC_AUXI: R513.2 U502.33(FSADJI/AUXI)
TXDAC_AUXQ: R514.2 U502.32(FSADJQ/AUXQ)
TXDAC_CLKIN: R502.2 U502.18(CLKIN) ; also sheet 3
TXDAC_D0: U502.15(DB0) ; also sheet 3
TXDAC_D1: U502.14(DB1) ; also sheet 3
TXDAC_D2: U502.13(DB2) ; also sheet 3
TXDAC_D3: U502.12(DB3) ; also sheet 3
TXDAC_D4: U502.11(DB4) ; also sheet 3
TXDAC_D5: U502.10(DB5) ; also sheet 3
TXDAC_D6: U502.9(DB6) ; also sheet 3
TXDAC_D7: U502.8(DB7) ; also sheet 3
TXDAC_D8: U502.4(DB8) ; also sheet 3
TXDAC_D9: U502.3(DB9) ; also sheet 3
TXDAC_D10: U502.2(DB10) ; also sheet 3
TXDAC_D11: U502.1(DB11) ; also sheet 3
TXDAC_D12: U502.40(DB12) ; also sheet 3
TXDAC_D13: U502.39(DB13) ; also sheet 3
TXDAC_DCLK: R502.1 U502.16(DCLKIO) ; also sheet 3
TXDAC_RESET: R505.1 U502.35(RESET/PINMD) ; also sheet 1
TXDAC_SCLK: U502.36(SCLK/CLKMD) ; also sheet 1
TXDAC_SDIO: U502.37(SDIO/FORMAT) ; also sheet 1
TXMIXER_EN: R501.2 U501.12(ENBL) ; also sheet 1
TXMIXER_IBBN: C525.1(C1) L506.2 R515.2 U501.14(IBBN)
TXMIXER_IBBP: C526.2(C2) L507.2 R513.1 R515.1 U501.13(IBBP)
TXMIXER_LON: U501.22(LOIN) ; also sheet 6
TXMIXER_LOP: U501.21(LOIP) ; also sheet 6
TXMIXER_OUT: R506.1 RFCON502.P$3(SIGNAL)
TXMIXER_QBBN: C527.1(C1) L508.2 R516.2 U501.17(QBBN)
TXMIXER_QBBP: C528.2(C2) L509.2 R514.1 R516.1 U501.18(QBBP)
TXMIXER_TEMP: C510.1(C1) R504.1 ; also sheet 1
TXPA_IN: C511.2(C2) R507.2 U503.1(RFIN)
TXPA_OUT: C513.2(C2) C515.1(C1) L501.1 U503.3(RFOUT)
Unconnected: U502.20(CMLQ) U502.21(RLQN) U502.24(RLQP) U502.27(RLIP) U502.30(RLIN) U502.31(CMLI)

### Notes on the sheet
- 5th order Butterworth LPF
  fc = 10 MHz
- 5th order Butterworth LPF
  fc = 10 MHz

## Sheet 6 of 10: TX LO Synthesizer
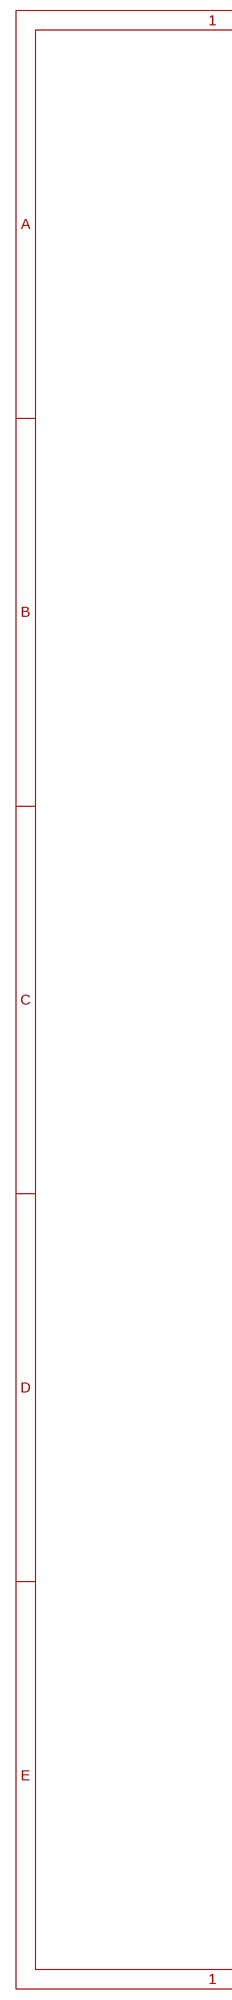
[diagram p10: schematic, sheet 6, part 1 of 2]
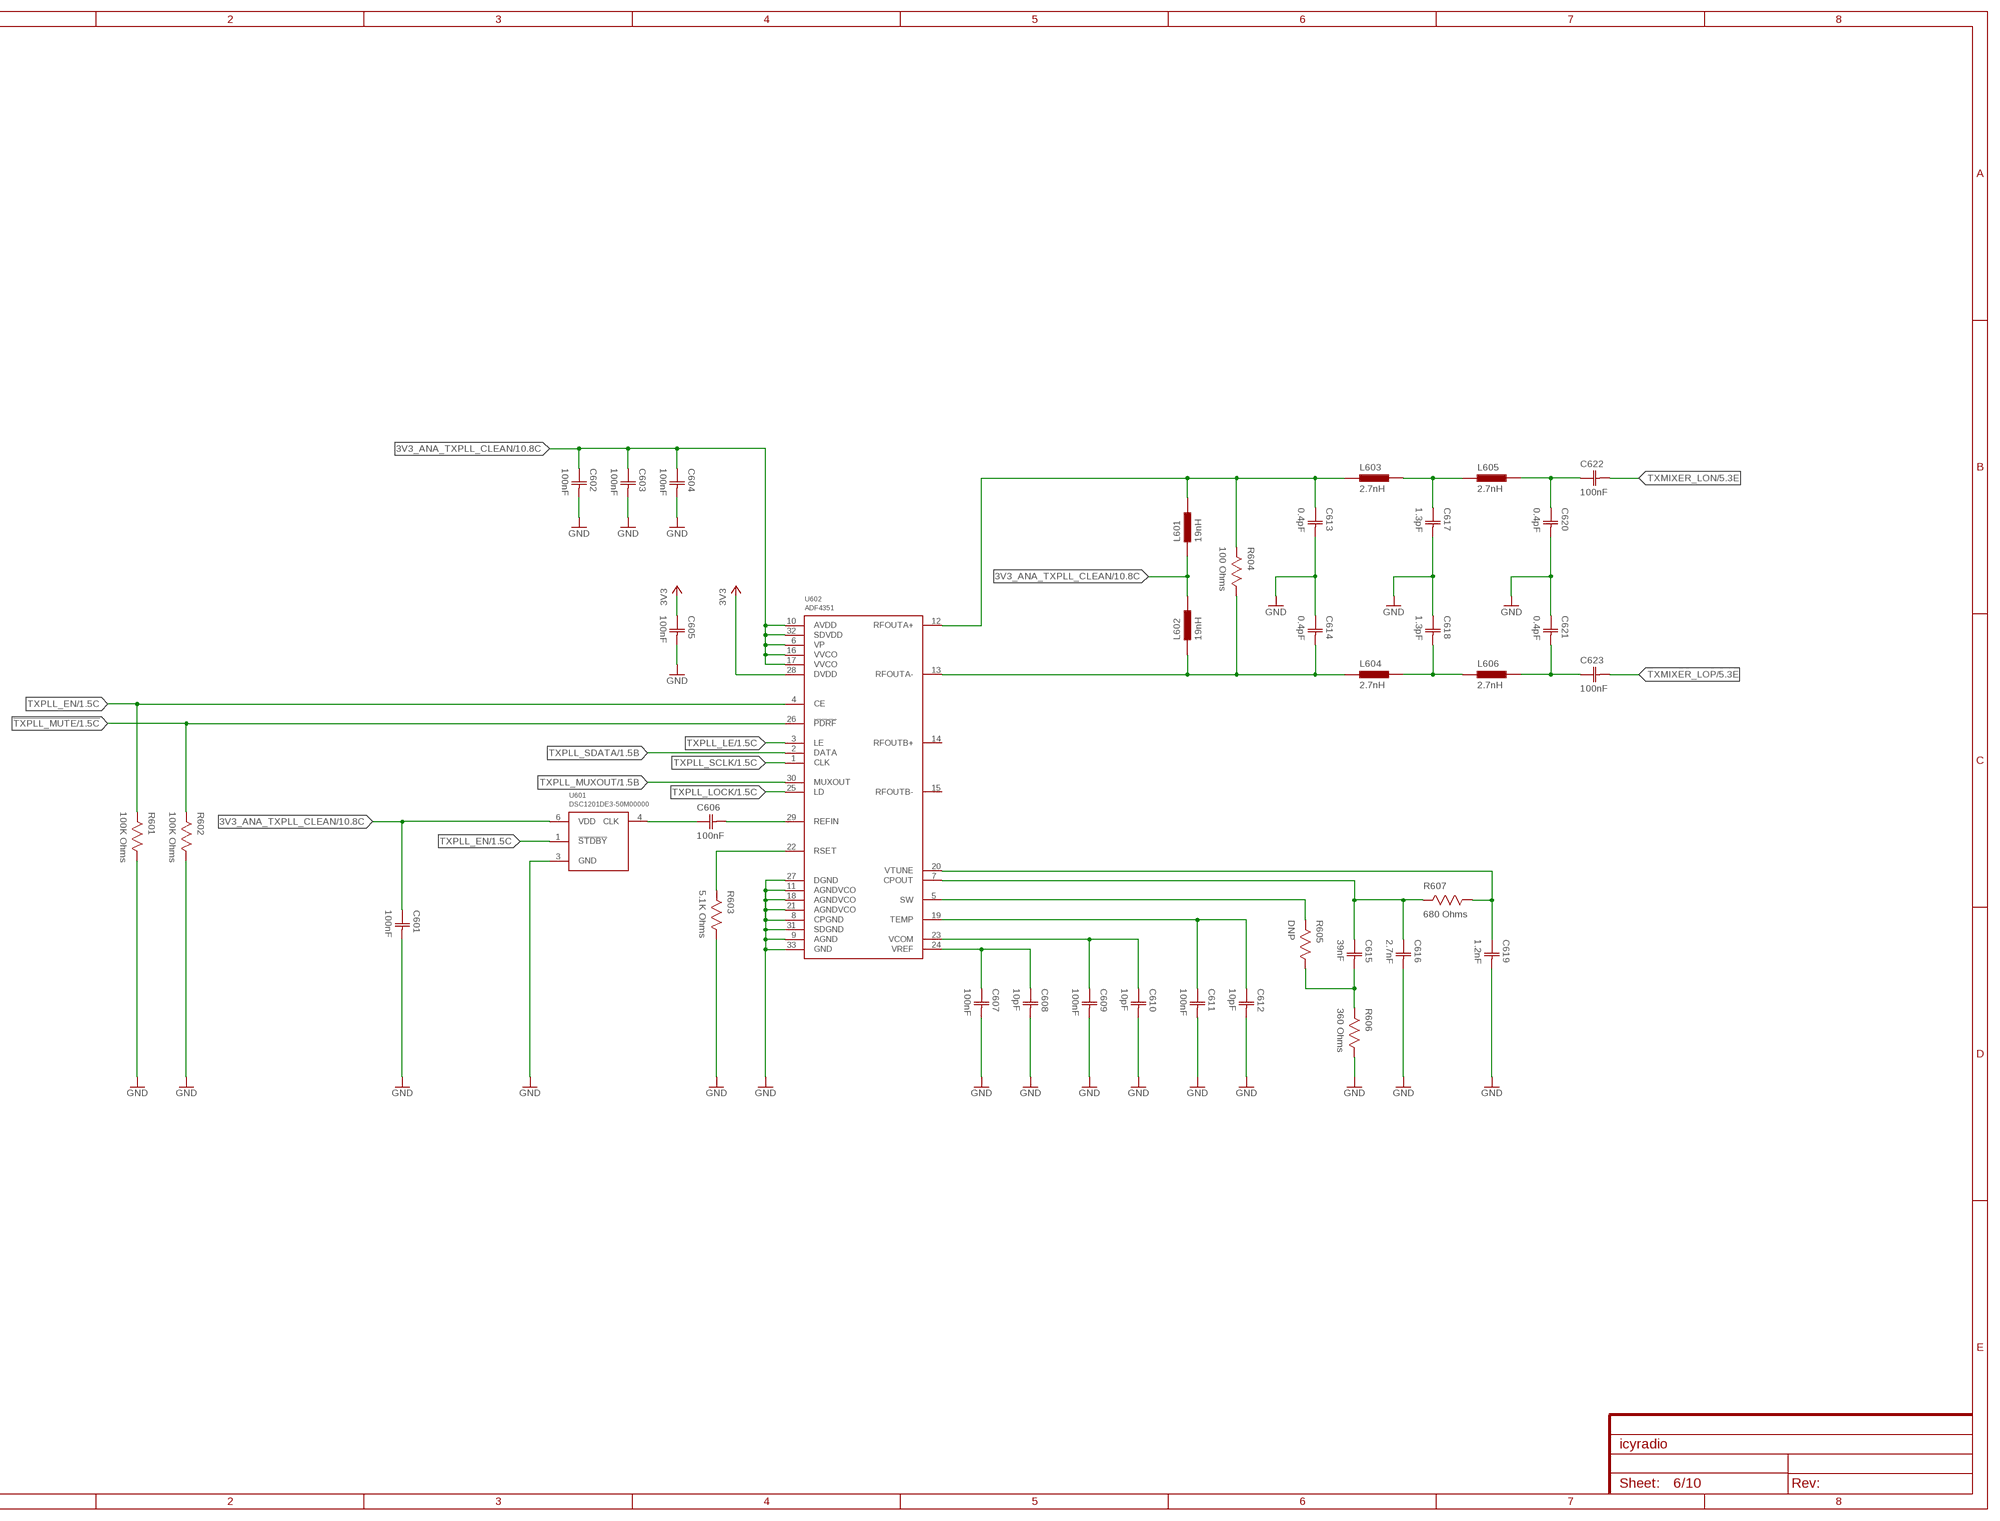
[diagram p11: schematic, sheet 6, part 2 of 2]

### Parts
C601  100nF  CAPACITOR-0603  [CAP0603]
C602  100nF  CAPACITOR-0603  [CAP0603]
C603  100nF  CAPACITOR-0603  [CAP0603]
C604  100nF  CAPACITOR-0603  [CAP0603]
C605  100nF  CAPACITOR-0603  [CAP0603]
C606  100nF  CAPACITOR-0603  [CAP0603]
C607  100nF  CAPACITOR-0603  [CAP0603]
C608  10pF  CAPACITOR-0603  [CAP0603]
C609  100nF  CAPACITOR-0603  [CAP0603]
C610  10pF  CAPACITOR-0603  [CAP0603]
C611  100nF  CAPACITOR-0603  [CAP0603]
C612  10pF  CAPACITOR-0603  [CAP0603]
C613  0.4pF  CAPACITOR-0603  [CAP0603]
C614  0.4pF  CAPACITOR-0603  [CAP0603]
C615  39nF  CAPACITOR-0603  [CAP0603]
C616  2.7nF  CAPACITOR-0603  [CAP0603]
C617  1.3pF  CAPACITOR-0603  [CAP0603]
C618  1.3pF  CAPACITOR-0603  [CAP0603]
C619  1.2nF  CAPACITOR-0603  [CAP0603]
C620  0.4pF  CAPACITOR-0603  [CAP0603]
C621  0.4pF  CAPACITOR-0603  [CAP0603]
C622  100nF  CAPACITOR-0603  [CAP0603]
C623  100nF  CAPACITOR-0603  [CAP0603]
L601  19nH  INDUCTOR-0603  [IND0603]
L602  19nH  INDUCTOR-0603  [IND0603]
L603  2.7nH  INDUCTOR-0603  [IND0603]
L604  2.7nH  INDUCTOR-0603  [IND0603]
L605  2.7nH  INDUCTOR-0603  [IND0603]
L606  2.7nH  INDUCTOR-0603  [IND0603]
R601  100K Ohms  RESISTOR-0603  [RES0603]
R602  100K Ohms  RESISTOR-0603  [RES0603]
R603  5.1K Ohms  RESISTOR-0603  [RES0603]
R604  100 Ohms  RESISTOR-0603  [RES0603]
R605  DNP  RESISTOR-0603  [RES0603]
R606  360 Ohms  RESISTOR-0603  [RES0603]
R607  680 Ohms  RESISTOR-0603  [RES0603]
U601  DSC1201DE3-50M00000  [VDFN6]
U602  ADF4351  [QFN32]

### Nets
3V3: C605.1(C1) U602.28(DVDD) ; also sheet 1,2,3,4,5,7,8,9,10
3V3_ANA_TXPLL_CLEAN: C601.1(C1) C602.1(C1) C603.1(C1) C604.1(C1) L601.1 L602.2 U601.6(VDD) U602.6(VP) U602.10(AVDD) U602.16(VVCO) U602.17(VVCO) U602.32(SDVDD) ; also sheet 10
!TXPLL_MUTE: R602.2 U602.26(!PDRF) ; also sheet 1
GND: C601.2(C2) C602.2(C2) C603.2(C2) C604.2(C2) C605.2(C2) C607.2(C2) C608.2(C2) C609.2(C2) C610.2(C2) C611.2(C2) C612.2(C2) C613.2(C2) C614.1(C1) C616.2(C2) C617.2(C2) C618.1(C1) C619.2(C2) C620.2(C2) C621.1(C1) R601.1 R602.1 R603.1 R606.1 U601.3(GND) U602.8(CPGND) U602.9(AGND) U602.11(AGNDVCO) U602.18(AGNDVCO) U602.21(AGNDVCO) U602.27(DGND) U602.31(SDGND) U602.33(GND) ; also sheet 1,2,3,4,5,7,8,9,10
N$67: C614.2(C2) L602.1 L604.1 R604.1 U602.13(RFOUTA-)
N$68: C618.2(C2) L604.2 L606.1
N$69: C613.1(C1) L601.2 L603.1 R604.2 U602.12(RFOUTA+)
N$70: C617.1(C1) L603.2 L605.1
N$71: C620.1(C1) C622.1(C1) L605.2
N$72: C621.2(C2) C623.1(C1) L606.2
N$84: C615.2(C2) R605.1 R606.2
N$88: R603.2 U602.22(RSET)
TXMIXER_LON: C622.2(C2) ; also sheet 5
TXMIXER_LOP: C623.2(C2) ; also sheet 5
TXPLL_CP_VOUT: C615.1(C1) C616.1(C1) R607.2 U602.7(CPOUT)
TXPLL_EN: R601.2 U601.1(!STDBY) U602.4(CE) ; also sheet 1
TXPLL_FASTLOCK_SW: R605.2 U602.5(SW)
TXPLL_LE: U602.3(LE) ; also sheet 1
TXPLL_LOCK: U602.25(LD) ; also sheet 1
TXPLL_MUXOUT: U602.30(MUXOUT) ; also sheet 1
TXPLL_REF_ACC: C606.2(C2) U602.29(REFIN)
TXPLL_REF_DCC: C606.1(C1) U601.4(CLK)
TXPLL_SCLK: U602.1(CLK) ; also sheet 1
TXPLL_SDATA: U602.2(DATA) ; also sheet 1
TXPLL_TEMP: C611.1(C1) C612.1(C1) U602.19(TEMP)
TXPLL_VCOM: C609.1(C1) C610.1(C1) U602.23(VCOM)
TXPLL_VREF: C607.1(C1) C608.1(C1) U602.24(VREF)
TXPLL_VTUNE: C619.1(C1) R607.1 U602.20(VTUNE)
Unconnected: U602.14(RFOUTB+) U602.15(RFOUTB-)

## Sheet 7 of 10: USB I2S bridge + CODEC
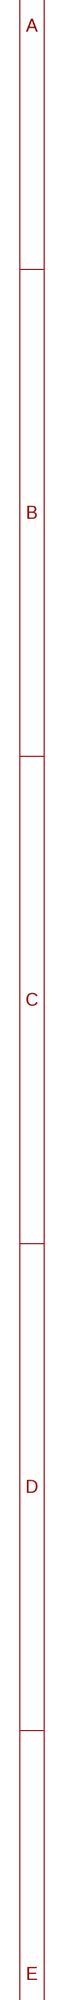
[diagram p12: schematic, sheet 7, part 1 of 2]
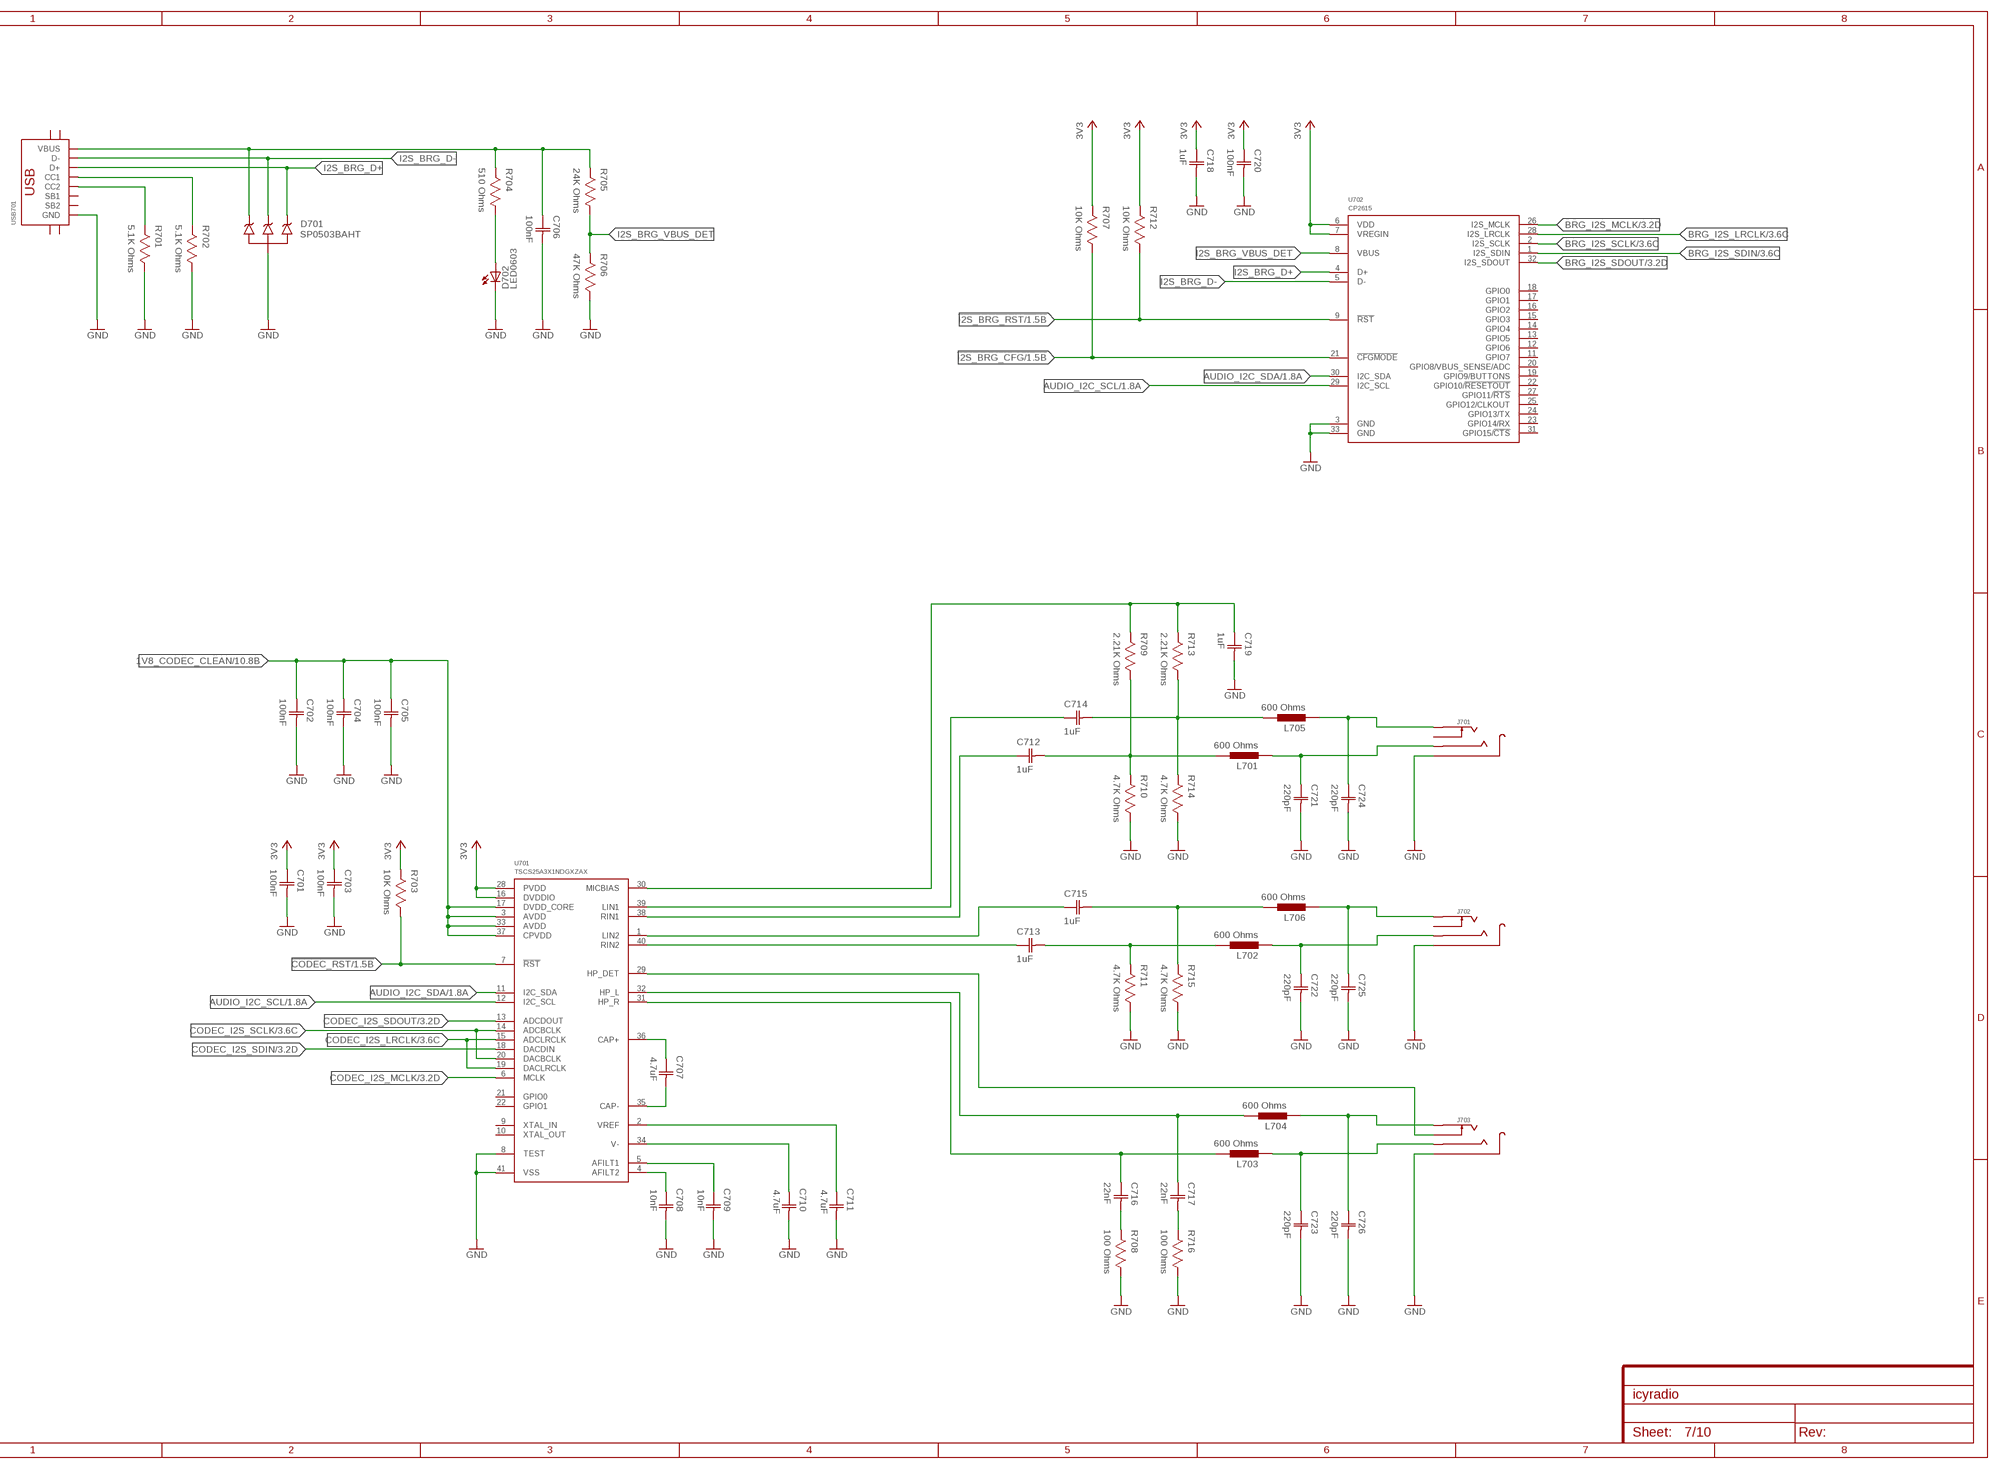
[diagram p13: schematic, sheet 7, part 2 of 2]

### Parts
C701  100nF  CAPACITOR-0603  [CAP0603]
C702  100nF  CAPACITOR-0603  [CAP0603]
C703  100nF  CAPACITOR-0603  [CAP0603]
C704  100nF  CAPACITOR-0603  [CAP0603]
C705  100nF  CAPACITOR-0603  [CAP0603]
C706  100nF  CAPACITOR-0603  [CAP0603]
C707  4.7uF  CAPACITOR-0603  [CAP0603]
C708  10nF  CAPACITOR-0603  [CAP0603]
C709  10nF  CAPACITOR-0603  [CAP0603]
C710  4.7uF  CAPACITOR-0603  [CAP0603]
C711  4.7uF  CAPACITOR-0603  [CAP0603]
C712  1uF  CAPACITOR-0603  [CAP0603]
C713  1uF  CAPACITOR-0603  [CAP0603]
C714  1uF  CAPACITOR-0603  [CAP0603]
C715  1uF  CAPACITOR-0603  [CAP0603]
C716  22nF  CAPACITOR-0603  [CAP0603]
C717  22nF  CAPACITOR-0603  [CAP0603]
C718  1uF  CAPACITOR-0603  [CAP0603]
C719  1uF  CAPACITOR-0603  [CAP0603]
C720  100nF  CAPACITOR-0603  [CAP0603]
C721  220pF  CAPACITOR-0603  [CAP0603]
C722  220pF  CAPACITOR-0603  [CAP0603]
C723  220pF  CAPACITOR-0603  [CAP0603]
C724  220pF  CAPACITOR-0603  [CAP0603]
C725  220pF  CAPACITOR-0603  [CAP0603]
C726  220pF  CAPACITOR-0603  [CAP0603]
D701  SP0503BAHT  [SOT143]
D702  LED0603  [0603]
J701  TRSJACK  [3.5TRSJACK]
J702  TRSJACK  [3.5TRSJACK]
J703  TRSJACK  [3.5TRSJACK]
L701  600 Ohms  INDUCTOR-0603  [IND0603]
L702  600 Ohms  INDUCTOR-0603  [IND0603]
L703  600 Ohms  INDUCTOR-0603  [IND0603]
L704  600 Ohms  INDUCTOR-0603  [IND0603]
L705  600 Ohms  INDUCTOR-0603  [IND0603]
L706  600 Ohms  INDUCTOR-0603  [IND0603]
R701  5.1K Ohms  RESISTOR-0603  [RES0603]
R702  5.1K Ohms  RESISTOR-0603  [RES0603]
R703  10K Ohms  RESISTOR-0603  [RES0603]
R704  510 Ohms  RESISTOR-0603  [RES0603]
R705  24K Ohms  RESISTOR-0603  [RES0603]
R706  47K Ohms  RESISTOR-0603  [RES0603]
R707  10K Ohms  RESISTOR-0603  [RES0603]
R708  100 Ohms  RESISTOR-0603  [RES0603]
R709  2.21K Ohms  RESISTOR-0603  [RES0603]
R710  4.7K Ohms  RESISTOR-0603  [RES0603]
R711  4.7K Ohms  RESISTOR-0603  [RES0603]
R712  10K Ohms  RESISTOR-0603  [RES0603]
R713  2.21K Ohms  RESISTOR-0603  [RES0603]
R714  4.7K Ohms  RESISTOR-0603  [RES0603]
R715  4.7K Ohms  RESISTOR-0603  [RES0603]
R716  100 Ohms  RESISTOR-0603  [RES0603]
U701  TSCS25A3X1NDGXZAX  [QFN40]
U702  CP2615  [QFN32]
USB701  USB-C-16P-SMD-FLAT-SIDE-TYPE-2  [USB-C-16P-SMD-FLAT-SIDE-TYPE-2]

### Nets
1V8_CODEC_CLEAN: C702.1(C1) C704.1(C1) C705.1(C1) U701.3(AVDD) U701.17(DVDD_CORE) U701.33(AVDD) U701.37(CPVDD) ; also sheet 10
3V3: C701.1(C1) C703.1(C1) C718.1(C1) C720.1(C1) R703.2 R707.2 R712.2 U701.16(DVDDIO) U701.28(PVDD) U702.6(VDD) U702.7(VREGIN) ; also sheet 1,2,3,4,5,6,8,9,10
!CODEC_RST: R703.1 U701.7(!RST) ; also sheet 1
!I2S_BRG_CFG: R707.1 U702.21(!CFGMODE) ; also sheet 1
!I2S_BRG_RST: R712.1 U702.9(!RST) ; also sheet 1
AUDIO_I2C_SCL: U701.12(I2C_SCL) U702.29(I2C_SCL) ; also sheet 1
AUDIO_I2C_SDA: U701.11(I2C_SDA) U702.30(I2C_SDA) ; also sheet 1
BRG_I2S_LRCLK: U702.28(I2S_LRCLK) ; also sheet 3
BRG_I2S_MCLK: U702.26(I2S_MCLK) ; also sheet 3
BRG_I2S_SCLK: U702.2(I2S_SCLK) ; also sheet 3
BRG_I2S_SDIN: U702.1(I2S_SDIN) ; also sheet 3
BRG_I2S_SDOUT: U702.32(I2S_SDOUT) ; also sheet 3
CODEC_AFILT1: C709.1(C1) U701.5(AFILT1)
CODEC_AFILT2: C708.1(C1) U701.4(AFILT2)
CODEC_CAP-: C707.2(C2) U701.35(CAP-)
CODEC_HP_L: C726.1(C1) J703.2(T) L704.1
CODEC_HP_R: C723.1(C1) J703.3(R) L703.1
CODEC_I2S_LRCLK: U701.15(ADCLRCLK) U701.19(DACLRCLK) ; also sheet 3
CODEC_I2S_MCLK: U701.6(MCLK) ; also sheet 3
CODEC_I2S_SCLK: U701.14(ADCBCLK) U701.20(DACBCLK) ; also sheet 3
CODEC_I2S_SDIN: U701.18(DACDIN) ; also sheet 3
CODEC_I2S_SDOUT: U701.13(ADCDOUT) ; also sheet 3
CODEC_LINE_L: C725.1(C1) J702.2(T) L706.1
CODEC_LINE_R: C722.1(C1) J702.3(R) L702.1
CODEC_MIC_L: C724.1(C1) J701.2(T) L705.1
CODEC_MIC_R: C721.1(C1) J701.3(R) L701.1
CODEC_V-: C710.1(C1) U701.34(V-)
CODEC_VREF: C711.1(C1) U701.2(VREF)
CPDEC_CAP+: C707.1(C1) U701.36(CAP+)
GND: C701.2(C2) C702.2(C2) C703.2(C2) C704.2(C2) C705.2(C2) C706.2(C2) C708.2(C2) C709.2(C2) C710.2(C2) C711.2(C2) C718.2(C2) C719.2(C2) C720.2(C2) C721.2(C2) C722.2(C2) C723.2(C2) C724.2(C2) C725.2(C2) C726.2(C2) D701.1 D702.1(C) J701.1(S) J702.1(S) J703.1(S) R701.1 R702.1 R706.1 R708.1 R710.1 R711.1 R714.1 R715.1 R716.1 U701.8(TEST) U701.41(VSS) U702.3(GND) U702.33(GND) USB701.A1/B12(GND) USB701.B1/A12(GND) ; also sheet 1,2,3,4,5,6,8,9,10
I2S_BRG_D+: D701.4 U702.4(D+) USB701.A6(D+) USB701.B6(D+)
I2S_BRG_D-: D701.3 U702.5(D-) USB701.A7(D-) USB701.B7(D-)
I2S_BRG_VBUS: C706.1(C1) D701.2 R704.2 R705.2 USB701.A4/B9(VBUS) USB701.B4/A9(VBUS)
I2S_BRG_VBUS_DET: R705.1 R706.2 U702.8(VBUS)
N$29: R701.2 USB701.B5(CC2)
N$30: R702.2 USB701.A5(CC1)
N$38: C712.2(C2) L701.2 R709.1 R710.2
N$39: C714.2(C2) L705.2 R713.1 R714.2
N$42: C713.2(C2) L702.2 R711.2
N$44: C715.2(C2) L706.2 R715.2
N$45: C712.1(C1) U701.38(RIN1)
N$46: C713.1(C1) U701.40(RIN2)
N$48: C714.1(C1) U701.39(LIN1)
N$50: C717.1(C1) L704.2 U701.32(HP_L)
N$51: J703.4(DT) U701.29(HP_DET)
N$52: C716.2(C2) R708.2
N$53: C717.2(C2) R716.2
N$54: C716.1(C1) L703.2 U701.31(HP_R)
N$55: C719.1(C1) R709.2 R713.2 U701.30(MICBIAS)
N$56: C715.1(C1) U701.1(LIN2)
N$147: D702.2(A) R704.1
Unconnected: J701.4(DT) J702.4(DT) U701.9(XTAL_IN) U701.10(XTAL_OUT) U701.21(GPIO0) U701.22(GPIO1) U702.11(GPIO7) U702.12(GPIO6) U702.13(GPIO5) U702.14(GPIO4) U702.15(GPIO3) U702.16(GPIO2) U702.17(GPIO1) U702.18(GPIO0) U702.19(GPIO9/BUTTONS) U702.20(GPIO8/VBUS_SENSE/ADC) U702.22(GPIO10/!RESETOUT!) U702.23(GPIO14/RX) U702.24(GPIO13/TX) U702.25(GPIO12/CLKOUT) U702.27(GPIO11/!RTS!) U702.31(GPIO15/!CTS!) USB701.A8(SB1) USB701.B8(SB2) USB701.SHIELD@0(SHIELD) USB701.SHIELD@1(SHIELD) USB701.SHIELD@2(SHIELD) USB701.SHIELD@3(SHIELD)

## Sheet 8 of 10: TFT Display
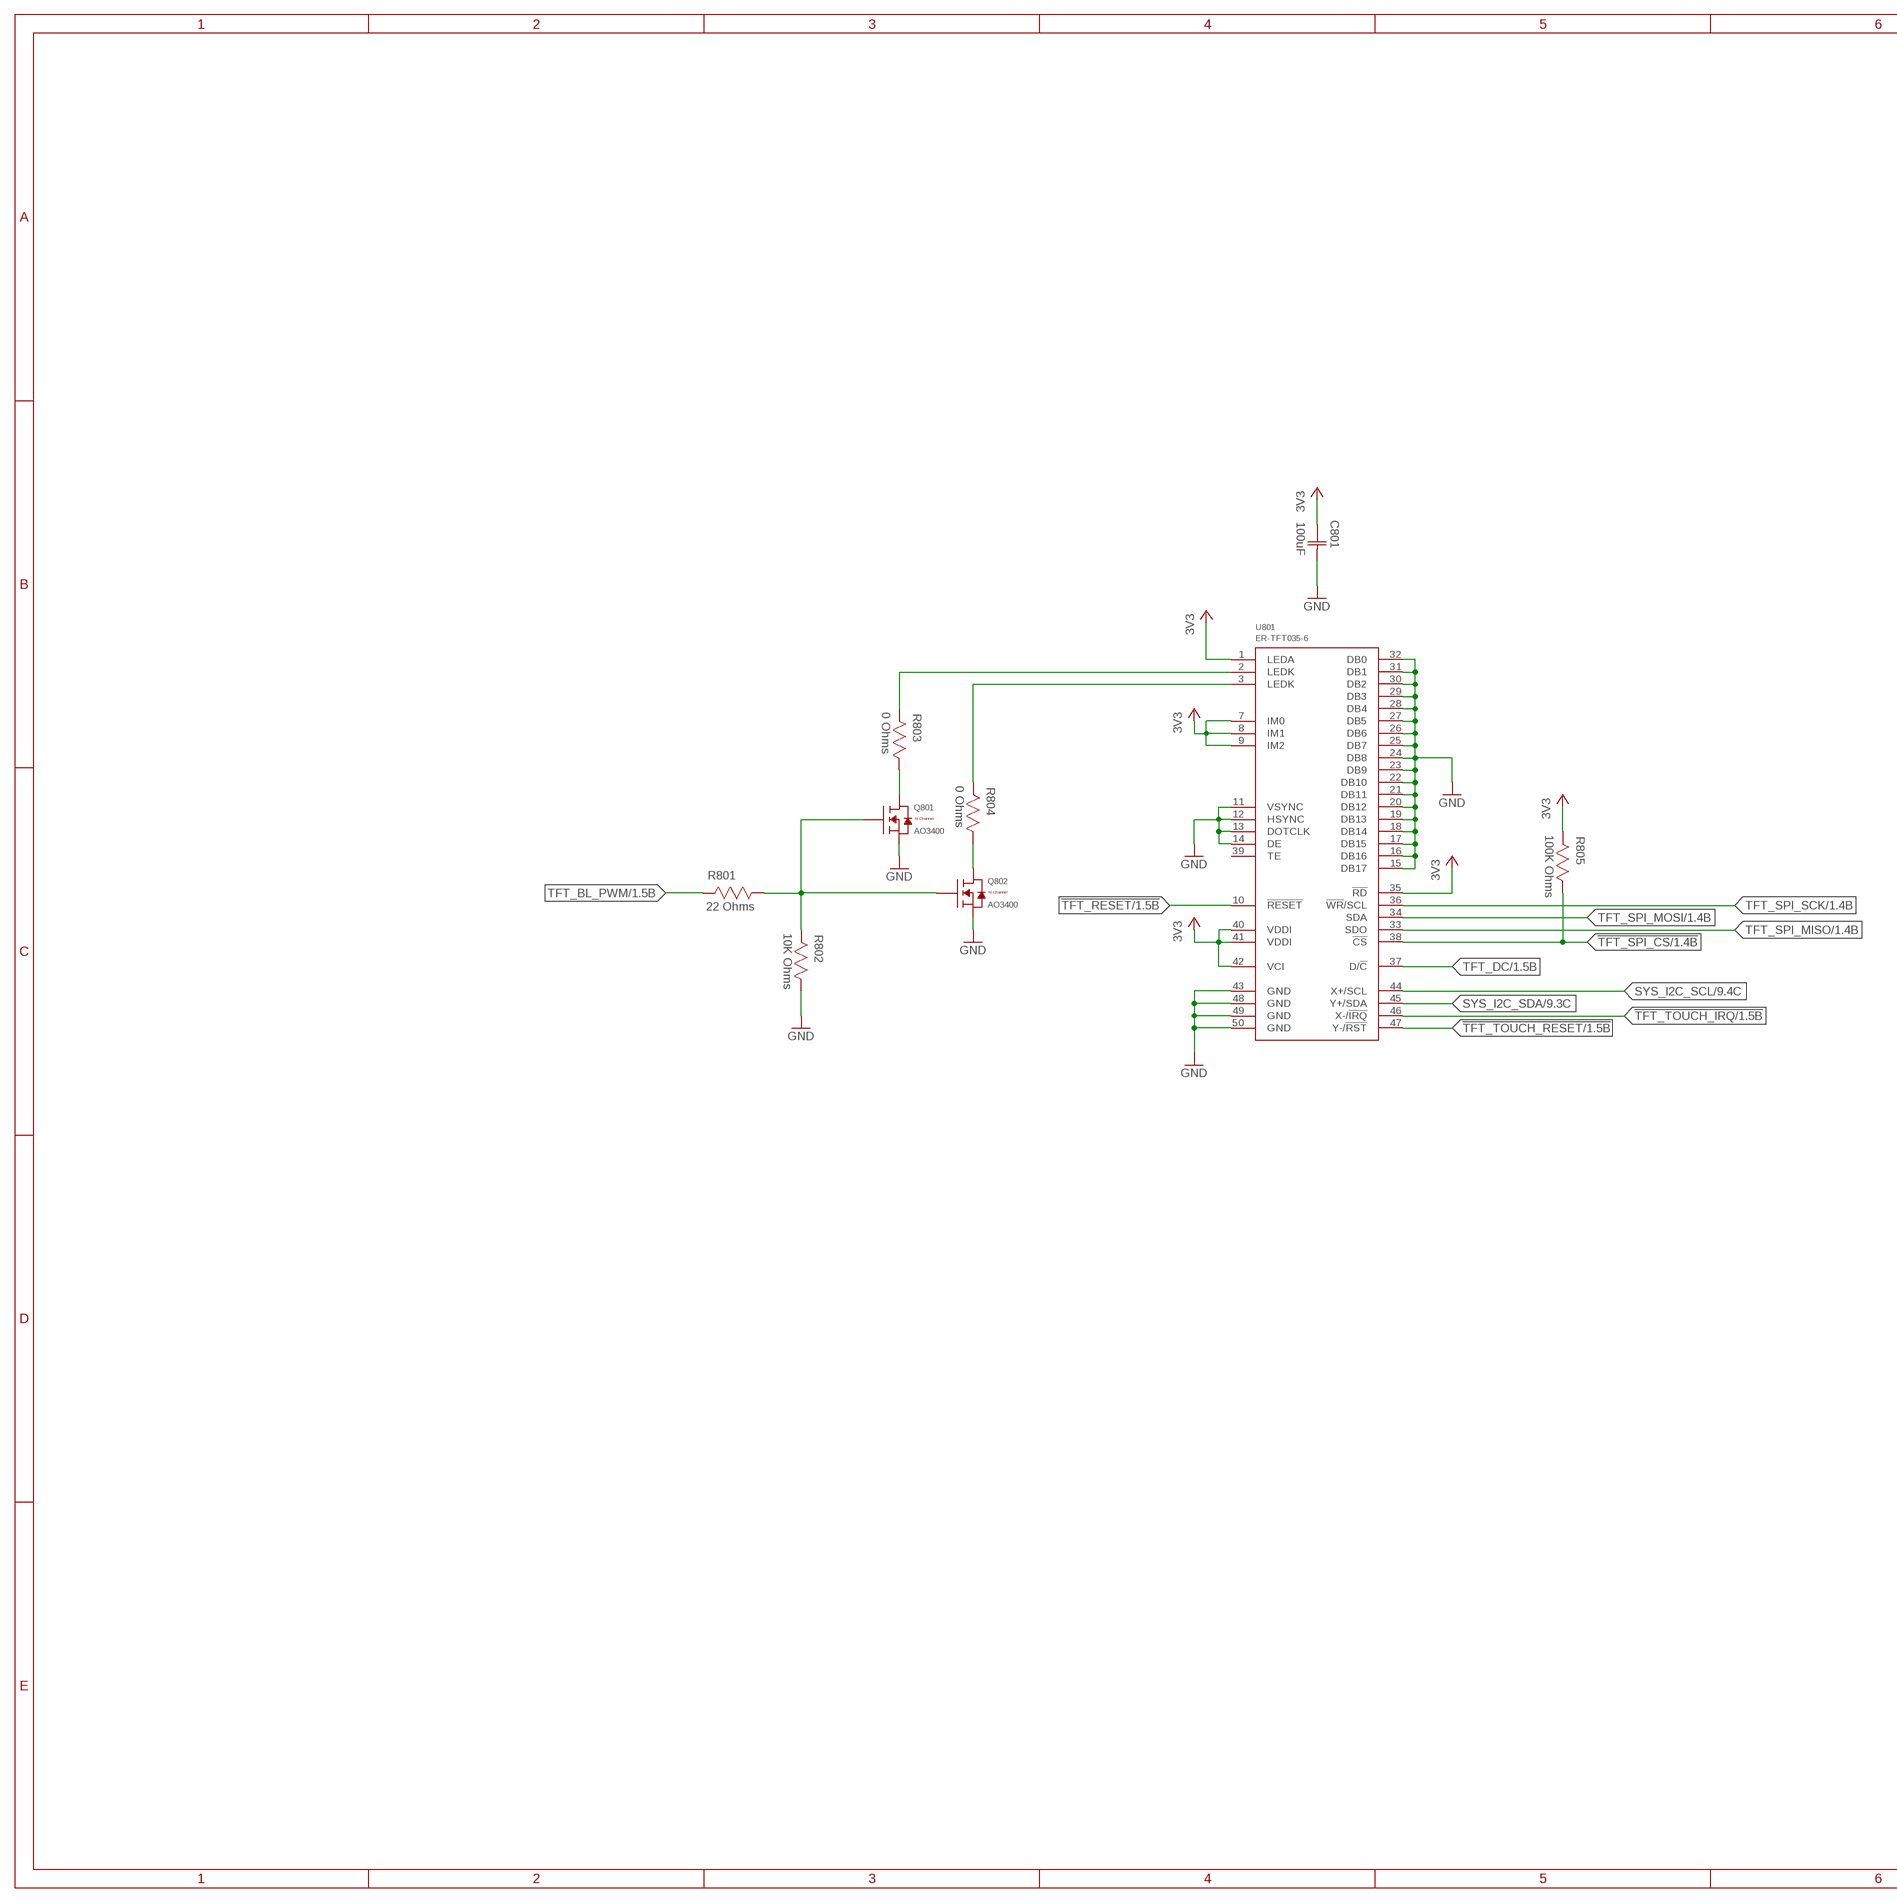
[diagram p14: schematic, sheet 8, part 1 of 2]
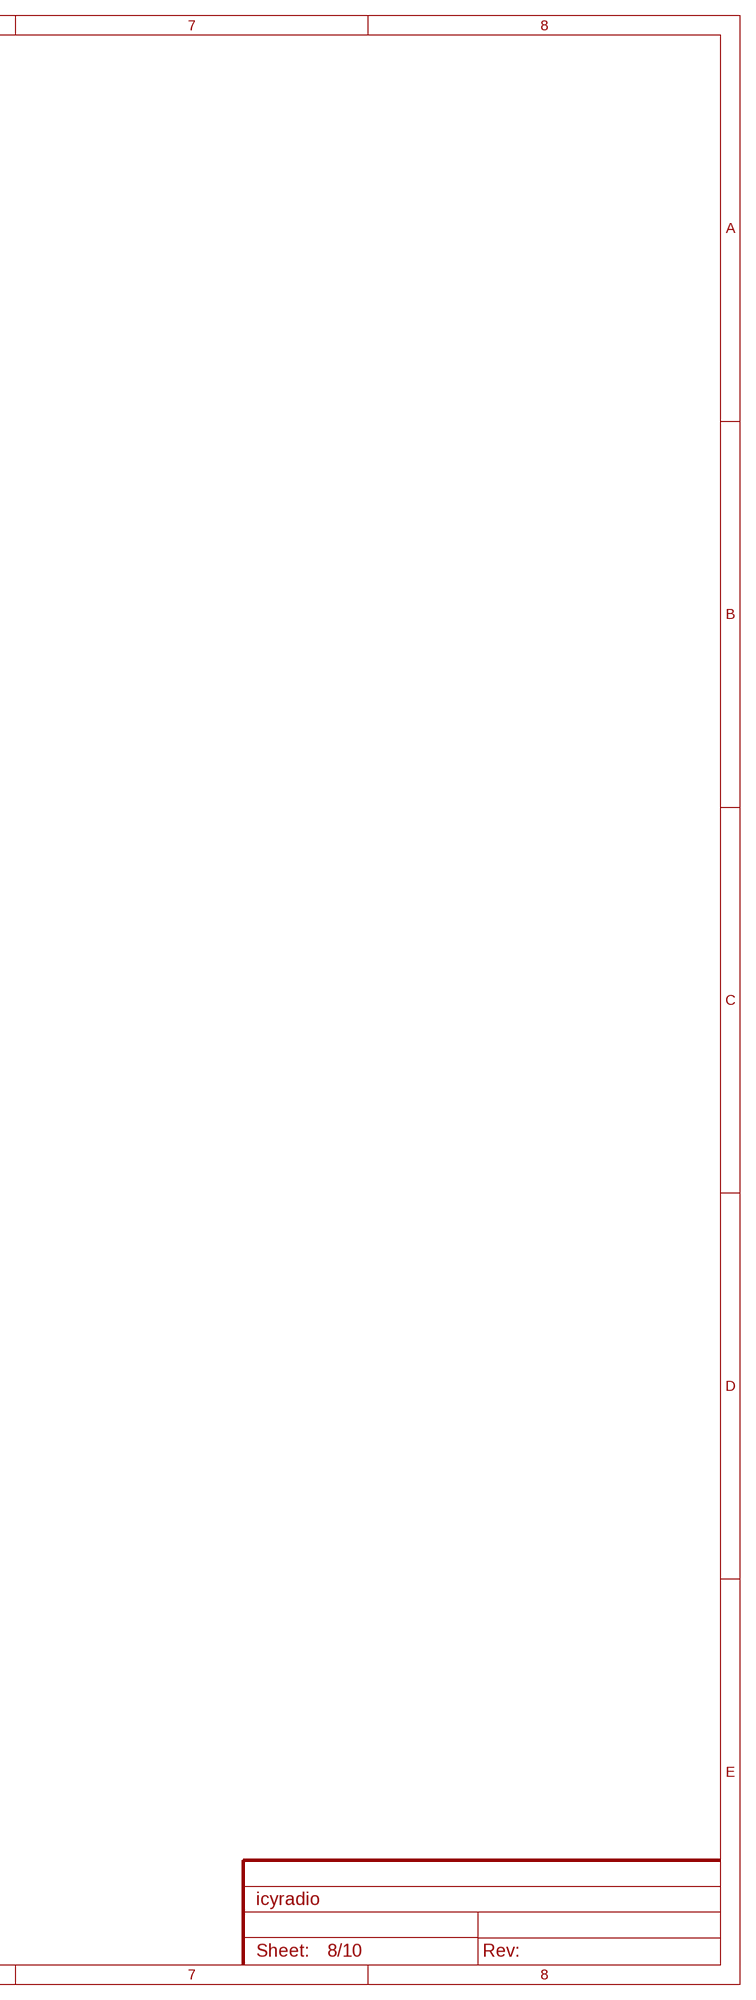
[diagram p15: schematic, sheet 8, part 2 of 2]

### Parts
C801  100uF  CAPACITOR-1206  [CAP1206]
Q801  AO3400  [SOT23]
Q802  AO3400  [SOT23]
R801  22 Ohms  RESISTOR-0603  [RES0603]
R802  10K Ohms  RESISTOR-0603  [RES0603]
R803  0 Ohms  RESISTOR-0603  [RES0603]
R804  0 Ohms  RESISTOR-0603  [RES0603]
R805  100K Ohms  RESISTOR-0603  [RES0603]
U801  ER-TFT035-6  [FPC-50P]

### Nets
3V3: C801.1(C1) R805.2 U801.1(LEDA) U801.7(IM0) U801.8(IM1) U801.9(IM2) U801.35(!RD) U801.40(VDDI) U801.41(VDDI) U801.42(VCI) ; also sheet 1,2,3,4,5,6,7,9,10
!TFT_RESET: U801.10(!RESET) ; also sheet 1
!TFT_SPI_CS: R805.1 U801.38(!CS) ; also sheet 1
!TFT_TOUCH_IRQ: U801.46(X-/!IRQ!) ; also sheet 1
!TFT_TOUCH_RESET: U801.47(Y-/!RST!) ; also sheet 1
GND: C801.2(C2) Q801.2(S) Q802.2(S) R802.1 U801.11(VSYNC) U801.12(HSYNC) U801.13(DOTCLK) U801.14(DE) U801.15(DB17) U801.16(DB16) U801.17(DB15) U801.18(DB14) U801.19(DB13) U801.20(DB12) U801.21(DB11) U801.22(DB10) U801.23(DB9) U801.24(DB8) U801.25(DB7) U801.26(DB6) U801.27(DB5) U801.28(DB4) U801.29(DB3) U801.30(DB2) U801.31(DB1) U801.32(DB0) U801.43(GND) U801.48(GND) U801.49(GND) U801.50(GND) ; also sheet 1,2,3,4,5,6,7,9,10
N$101: Q802.3(D) R804.1
N$102: Q801.3(D) R803.1
N$103: Q801.1(G) Q802.1(G) R801.1 R802.2
SYS_I2C_SCL: U801.44(X+/SCL) ; also sheet 1,9
SYS_I2C_SDA: U801.45(Y+/SDA) ; also sheet 1,9
TFT_BL_K1: R803.2 U801.2(LEDK)
TFT_BL_K2: R804.2 U801.3(LEDK)
TFT_BL_PWM: R801.2 ; also sheet 1
TFT_DC: U801.37(D/!C!) ; also sheet 1
TFT_SPI_MISO: U801.33(SDO) ; also sheet 1
TFT_SPI_MOSI: U801.34(SDA) ; also sheet 1
TFT_SPI_SCK: U801.36(!WR!/SCL) ; also sheet 1
Unconnected: U801.39(TE)

## Sheet 9 of 10: Clock generator
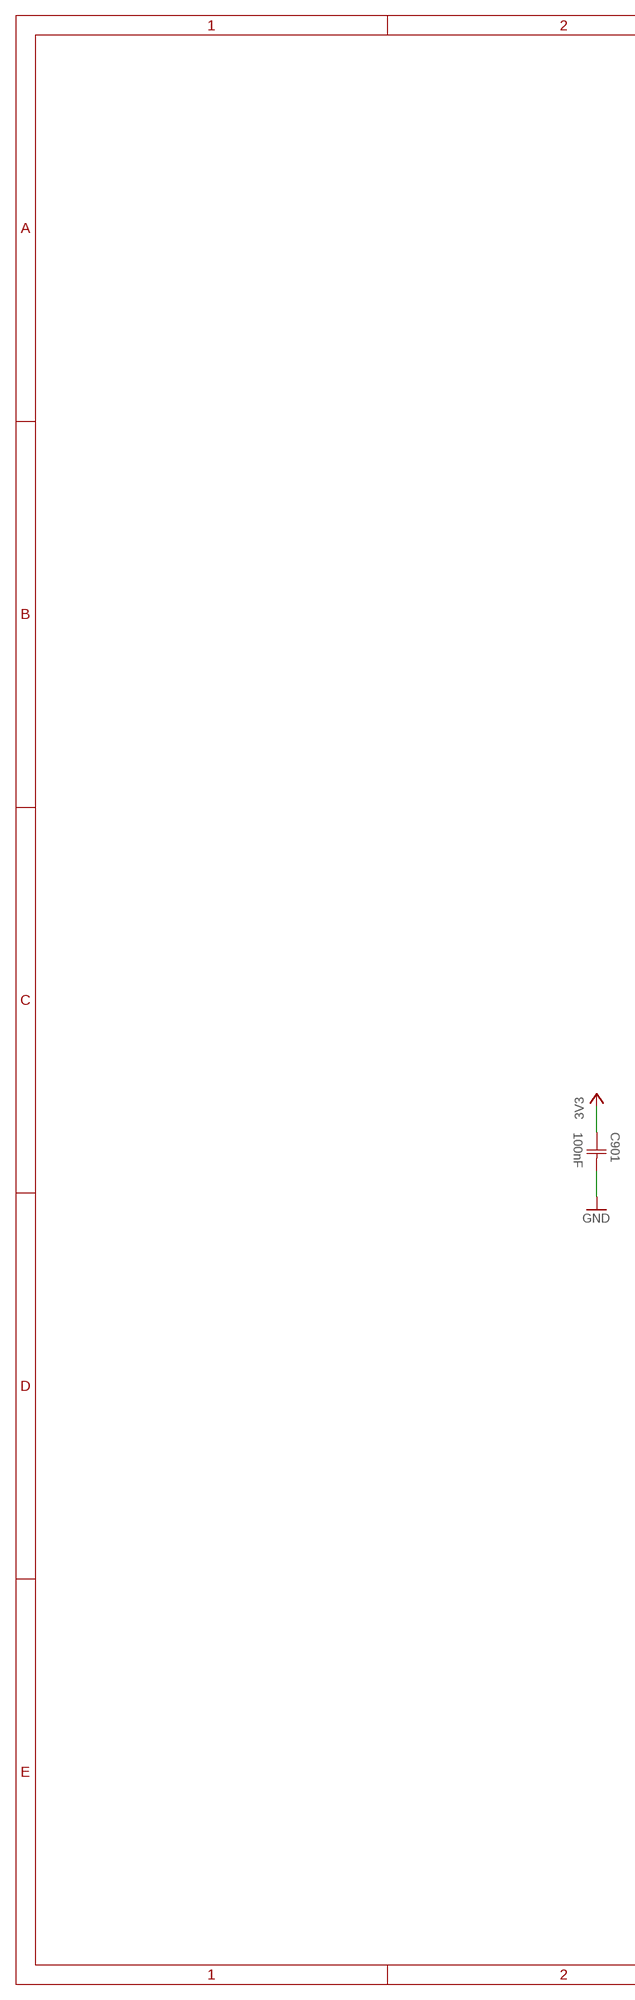
[diagram p16: schematic, sheet 9, part 1 of 2]
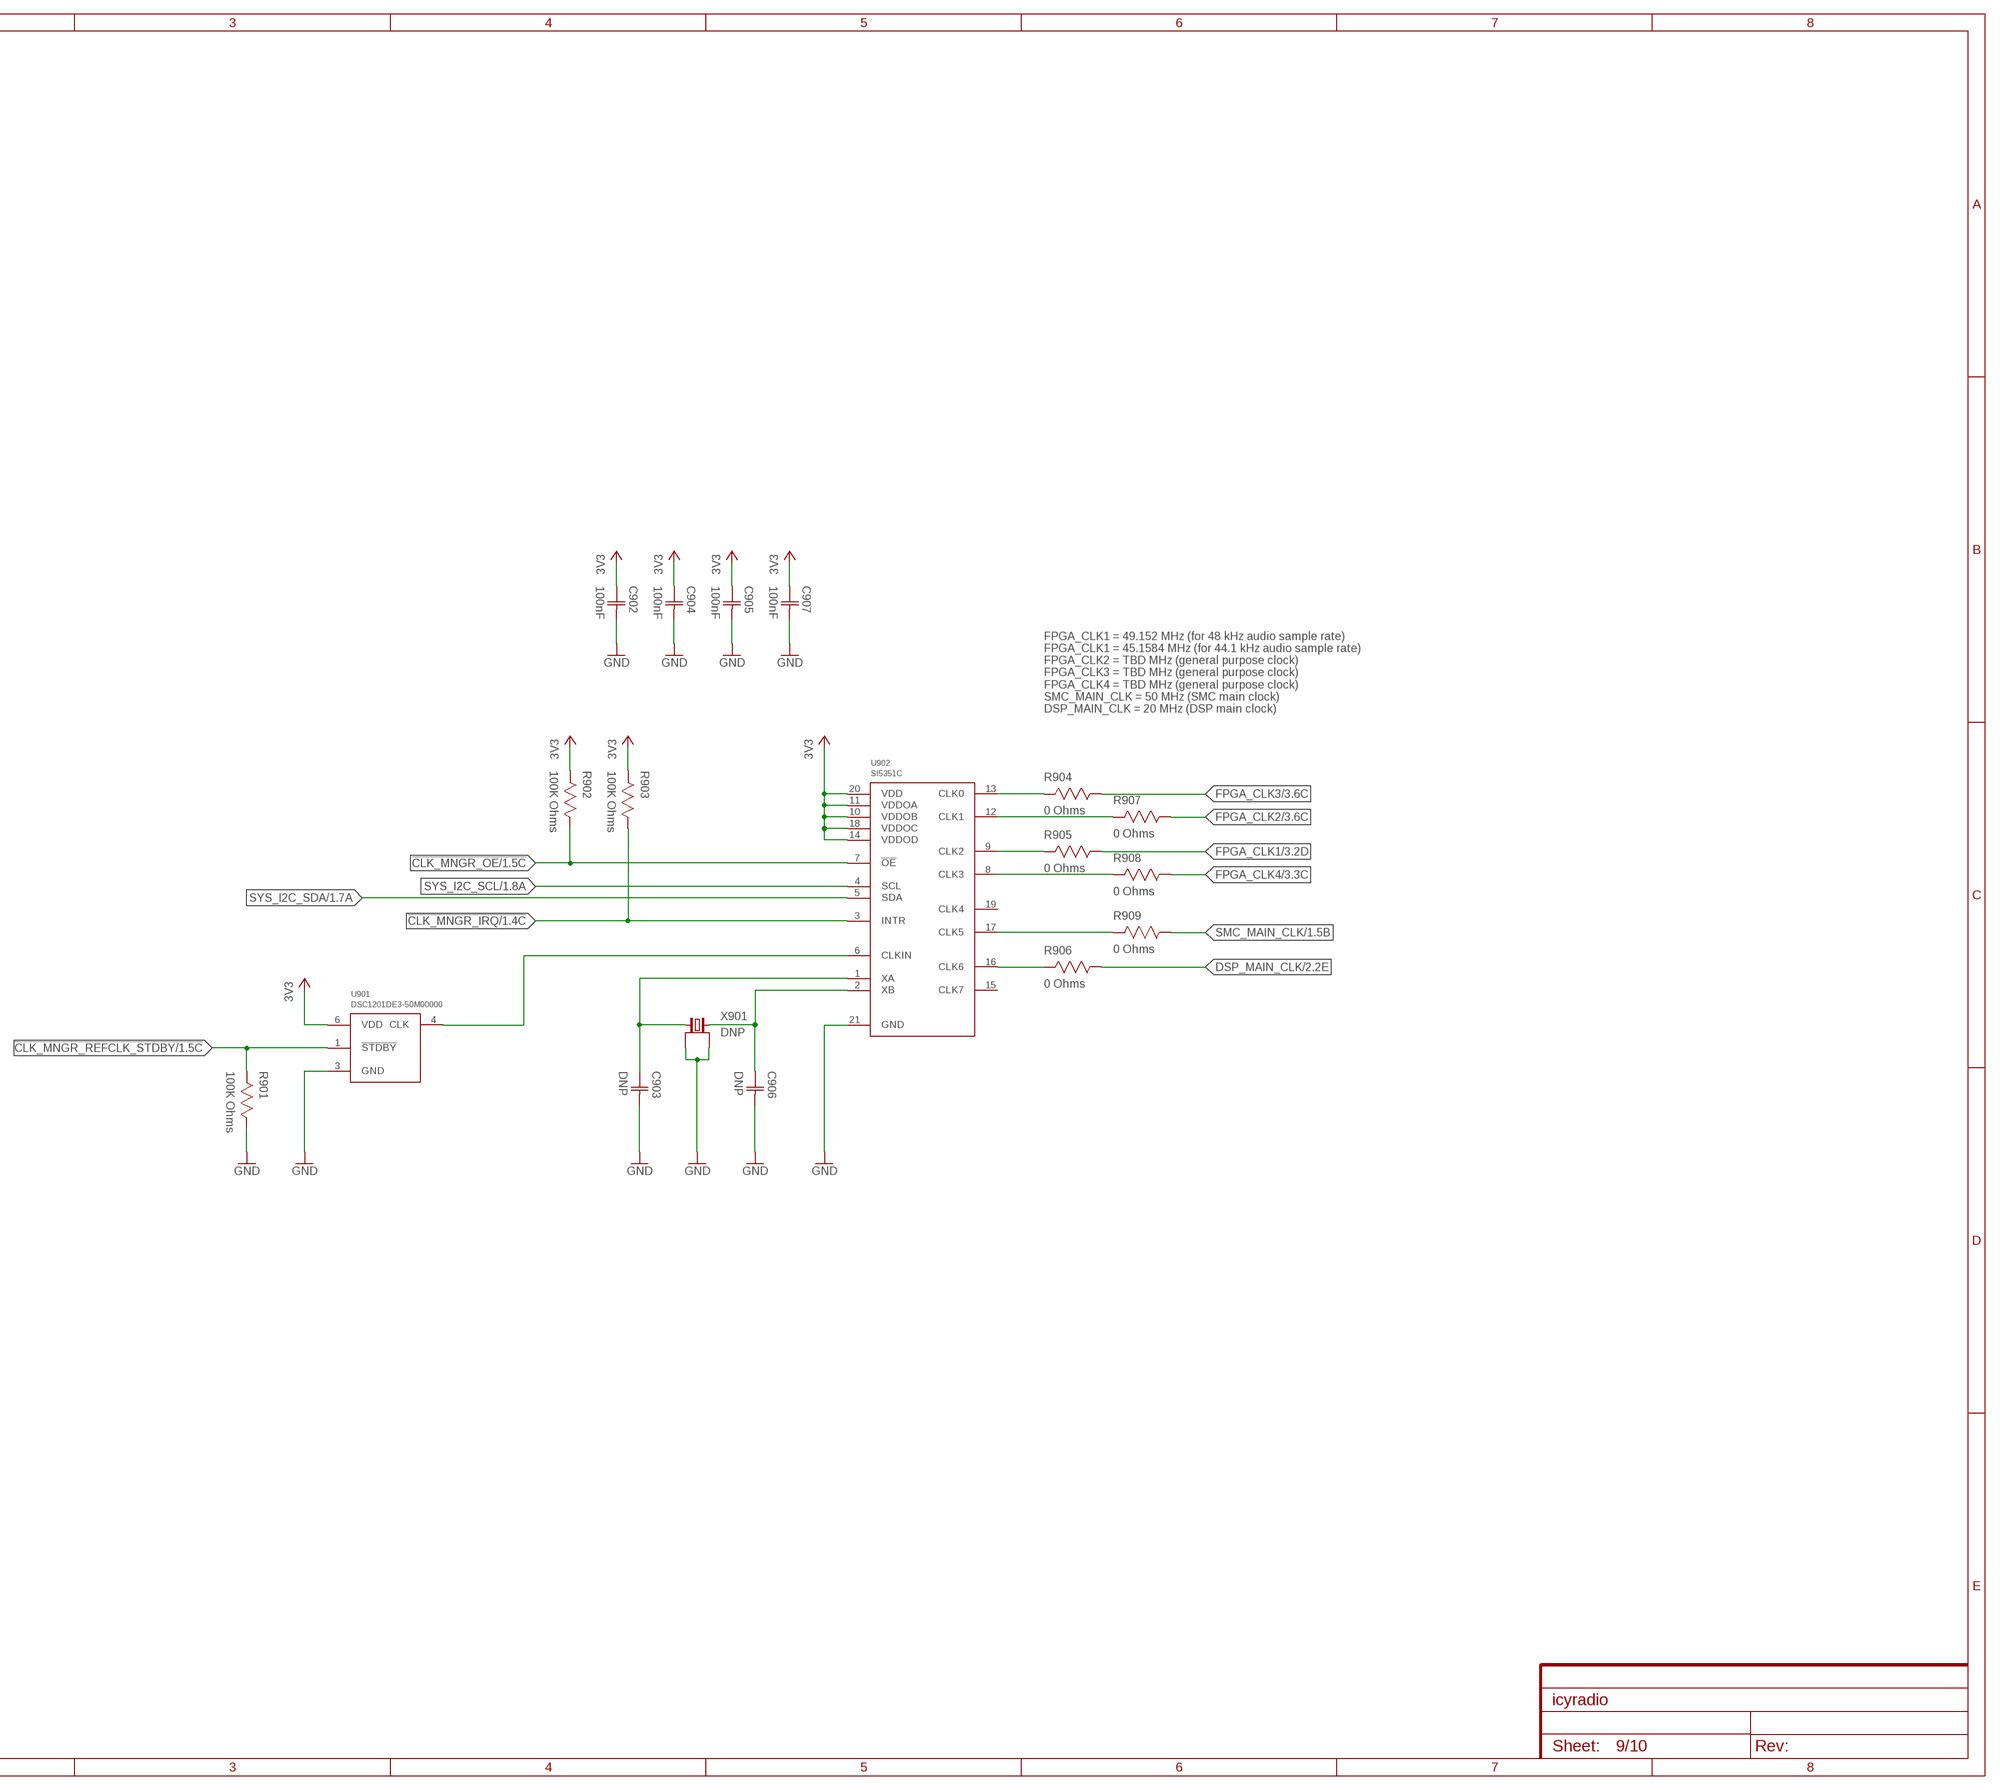
[diagram p17: schematic, sheet 9, part 2 of 2]

### Parts
C901  100nF  CAPACITOR-0603  [CAP0603]
C902  100nF  CAPACITOR-0603  [CAP0603]
C903  DNP  CAPACITOR-0603  [CAP0603]
C904  100nF  CAPACITOR-0603  [CAP0603]
C905  100nF  CAPACITOR-0603  [CAP0603]
C906  DNP  CAPACITOR-0603  [CAP0603]
C907  100nF  CAPACITOR-0603  [CAP0603]
R901  100K Ohms  RESISTOR-0603  [RES0603]
R902  100K Ohms  RESISTOR-0603  [RES0603]
R903  100K Ohms  RESISTOR-0603  [RES0603]
R904  0 Ohms  RESISTOR-0603  [RES0603]
R905  0 Ohms  RESISTOR-0603  [RES0603]
R906  0 Ohms  RESISTOR-0603  [RES0603]
R907  0 Ohms  RESISTOR-0603  [RES0603]
R908  0 Ohms  RESISTOR-0603  [RES0603]
R909  0 Ohms  RESISTOR-0603  [RES0603]
U901  DSC1201DE3-50M00000  [VDFN6]
U902  SI5351C  [QFN20]
X901  DNP  CRYSTAL_4P  [4-SMD-3225]

### Nets
3V3: C901.1(C1) C902.1(C1) C904.1(C1) C905.1(C1) C907.1(C1) R902.2 R903.2 U901.6(VDD) U902.10(VDDOB) U902.11(VDDOA) U902.14(VDDOD) U902.18(VDDOC) U902.20(VDD) ; also sheet 1,2,3,4,5,6,7,8,10
!CLK_MNGR_IRQ: R903.1 U902.3(INTR) ; also sheet 1
!CLK_MNGR_OE: R902.1 U902.7(!OE) ; also sheet 1
!CLK_MNGR_REFCLK_STDBY: R901.2 U901.1(!STDBY) ; also sheet 1
CLK_MNGR_CLK0: R904.2 U902.13(CLK0)
CLK_MNGR_CLK1: R907.2 U902.12(CLK1)
CLK_MNGR_CLK2: R905.2 U902.9(CLK2)
CLK_MNGR_CLK3: R908.2 U902.8(CLK3)
CLK_MNGR_CLK5: R909.2 U902.17(CLK5)
CLK_MNGR_CLK6: R906.2 U902.16(CLK6)
CLK_MNGR_REF: U901.4(CLK) U902.6(CLKIN)
CLK_MNGR_XTALA: C903.1(C1) U902.1(XA) X901.2
CLK_MNGR_XTALB: C906.1(C1) U902.2(XB) X901.4
DSP_MAIN_CLK: R906.1 ; also sheet 2
FPGA_CLK1: R905.1 ; also sheet 3
FPGA_CLK2: R907.1 ; also sheet 3
FPGA_CLK3: R904.1 ; also sheet 3
FPGA_CLK4: R908.1 ; also sheet 3
GND: C901.2(C2) C902.2(C2) C903.2(C2) C904.2(C2) C905.2(C2) C906.2(C2) C907.2(C2) R901.1 U901.3(GND) U902.21(GND) X901.1(GND) X901.3(GND) ; also sheet 1,2,3,4,5,6,7,8,10
SMC_MAIN_CLK: R909.1 ; also sheet 1
SYS_I2C_SCL: U902.4(SCL) ; also sheet 1,8
SYS_I2C_SDA: U902.5(SDA) ; also sheet 1,8
Unconnected: U902.15(CLK7) U902.19(CLK4)

### Notes on the sheet
- FPGA_CLK1 = 49.152 MHz (for 48 kHz audio sample rate)
  FPGA_CLK1 = 45.1584 MHz (for 44.1 kHz audio sample rate)
  FPGA_CLK2 = TBD MHz (general purpose clock)
  FPGA_CLK3 = TBD MHz (general purpose clock)
  FPGA_CLK4 = TBD MHz (general purpose clock)
  SMC_MAIN_CLK = 50 MHz (SMC main clock)
  DSP_MAIN_CLK = 20 MHz (DSP main clock)